# EAGLE board MasterPCB_transfer (EAGLE 9.6.2), part 1 of 7
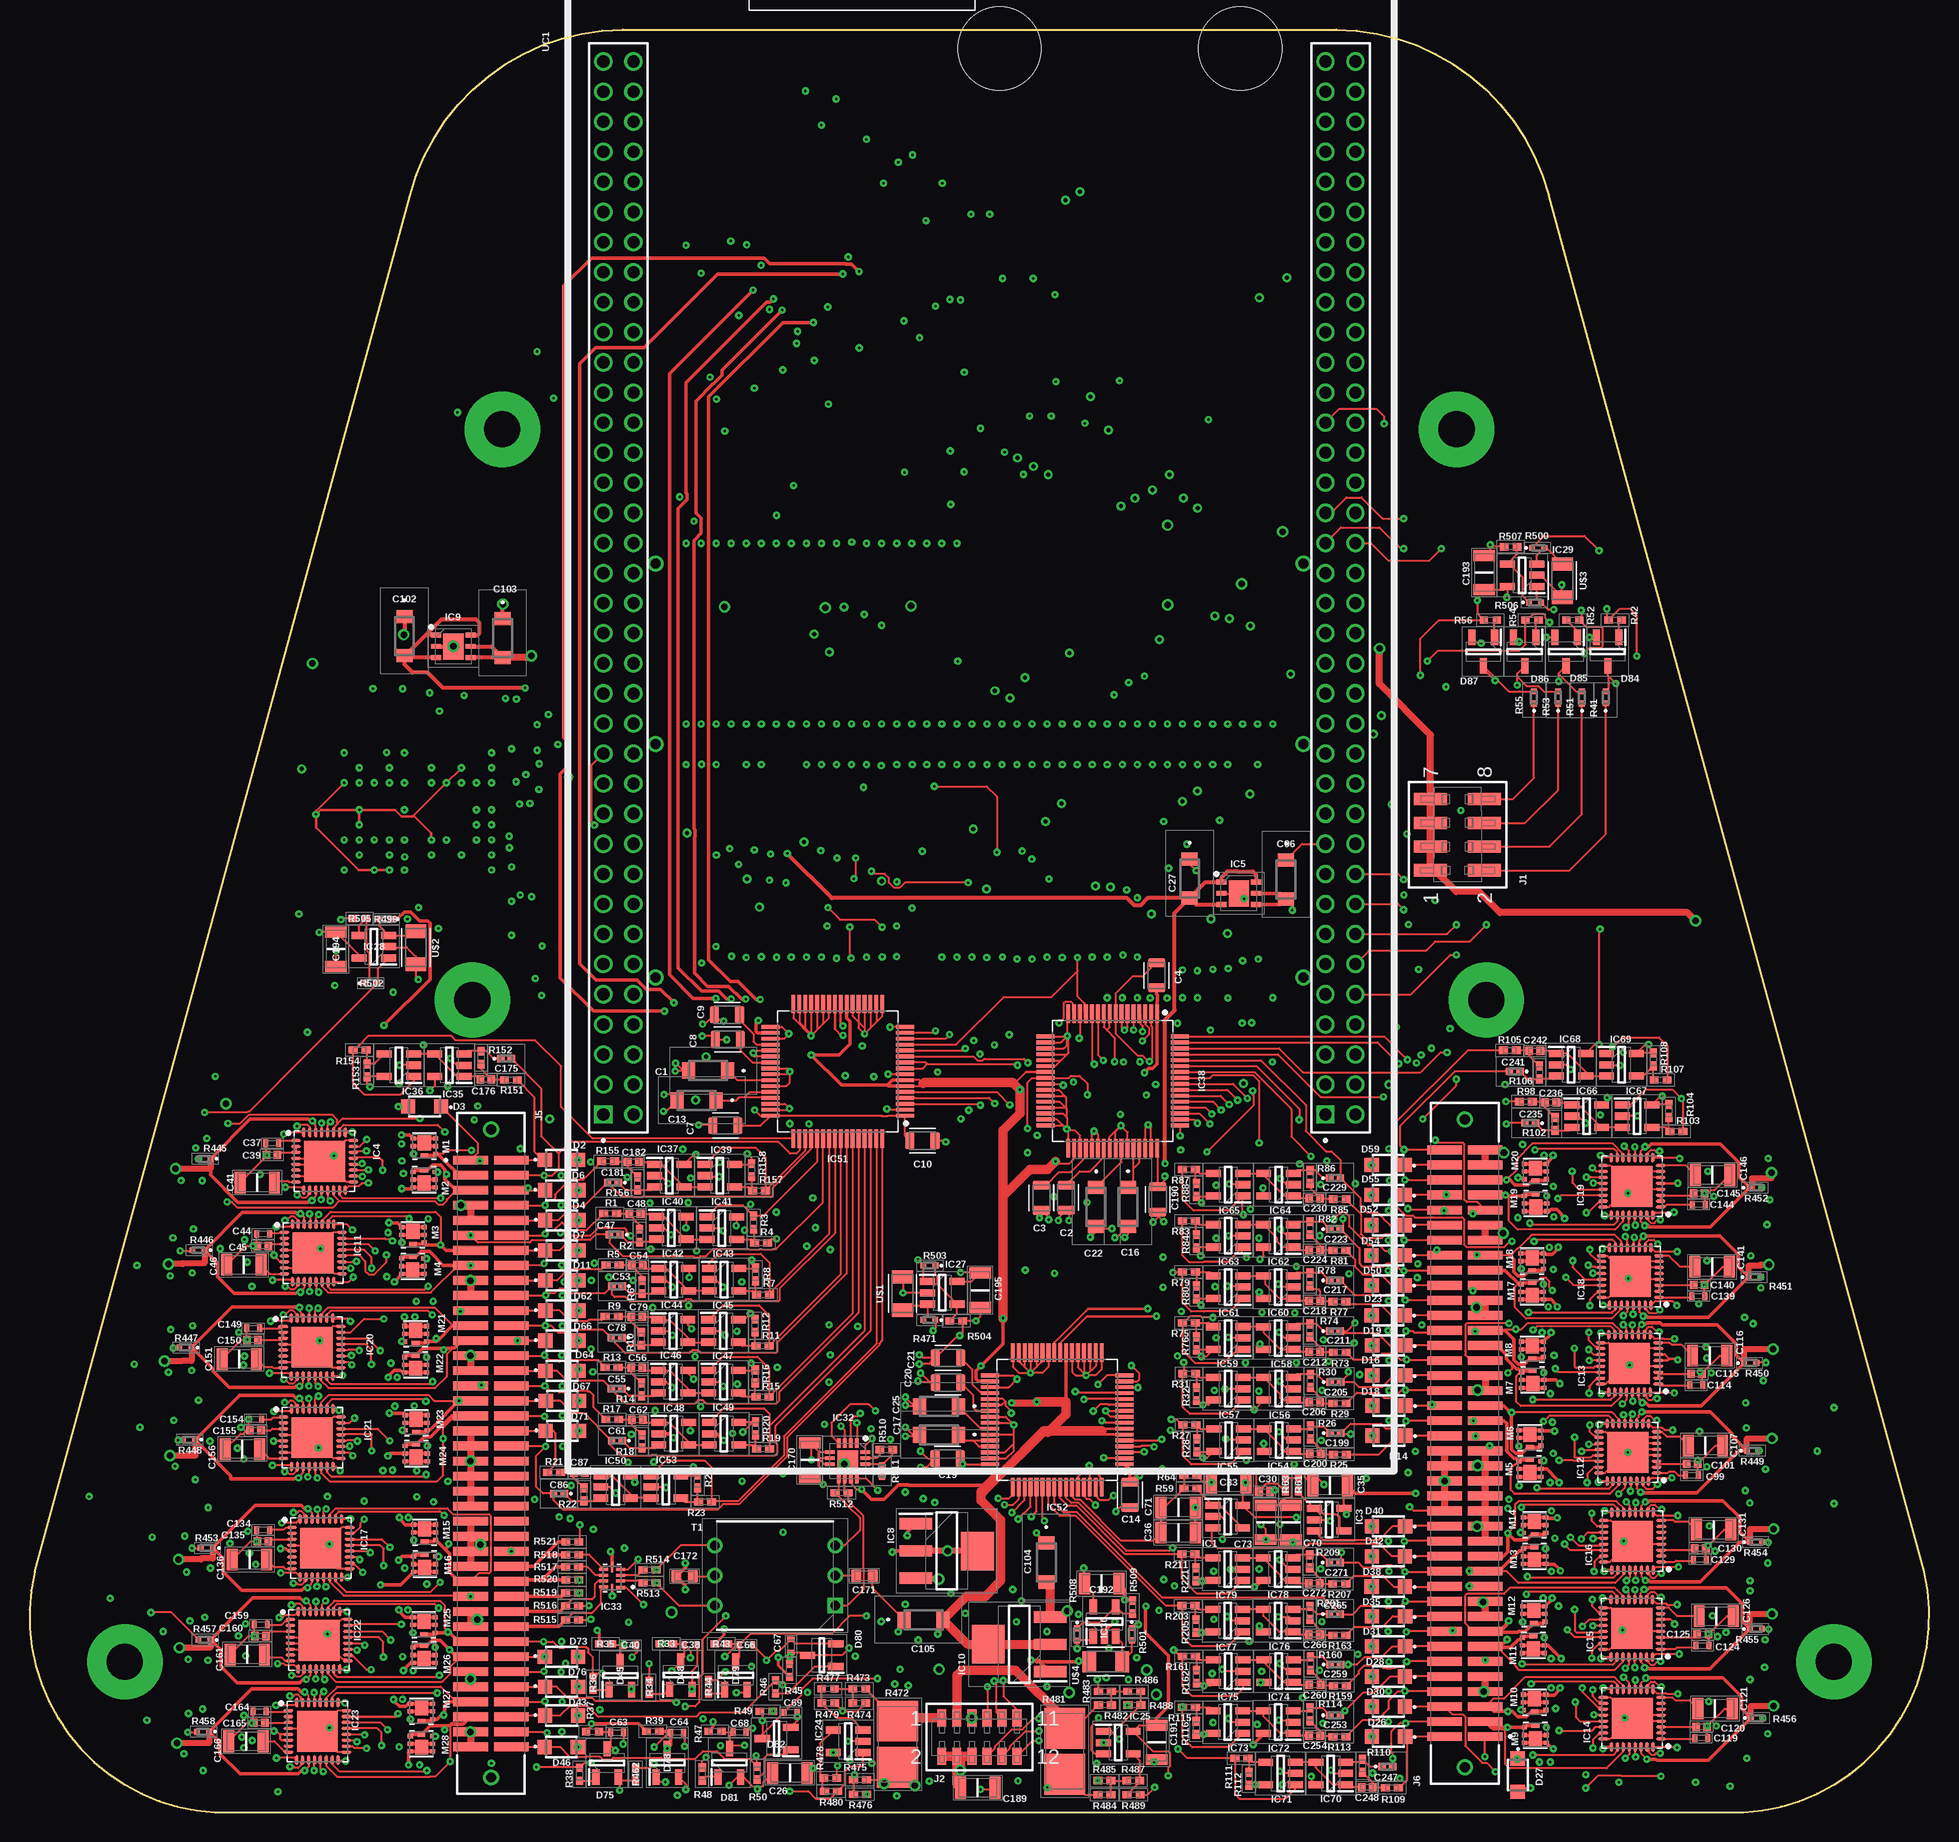
[diagram p21: board, top side]
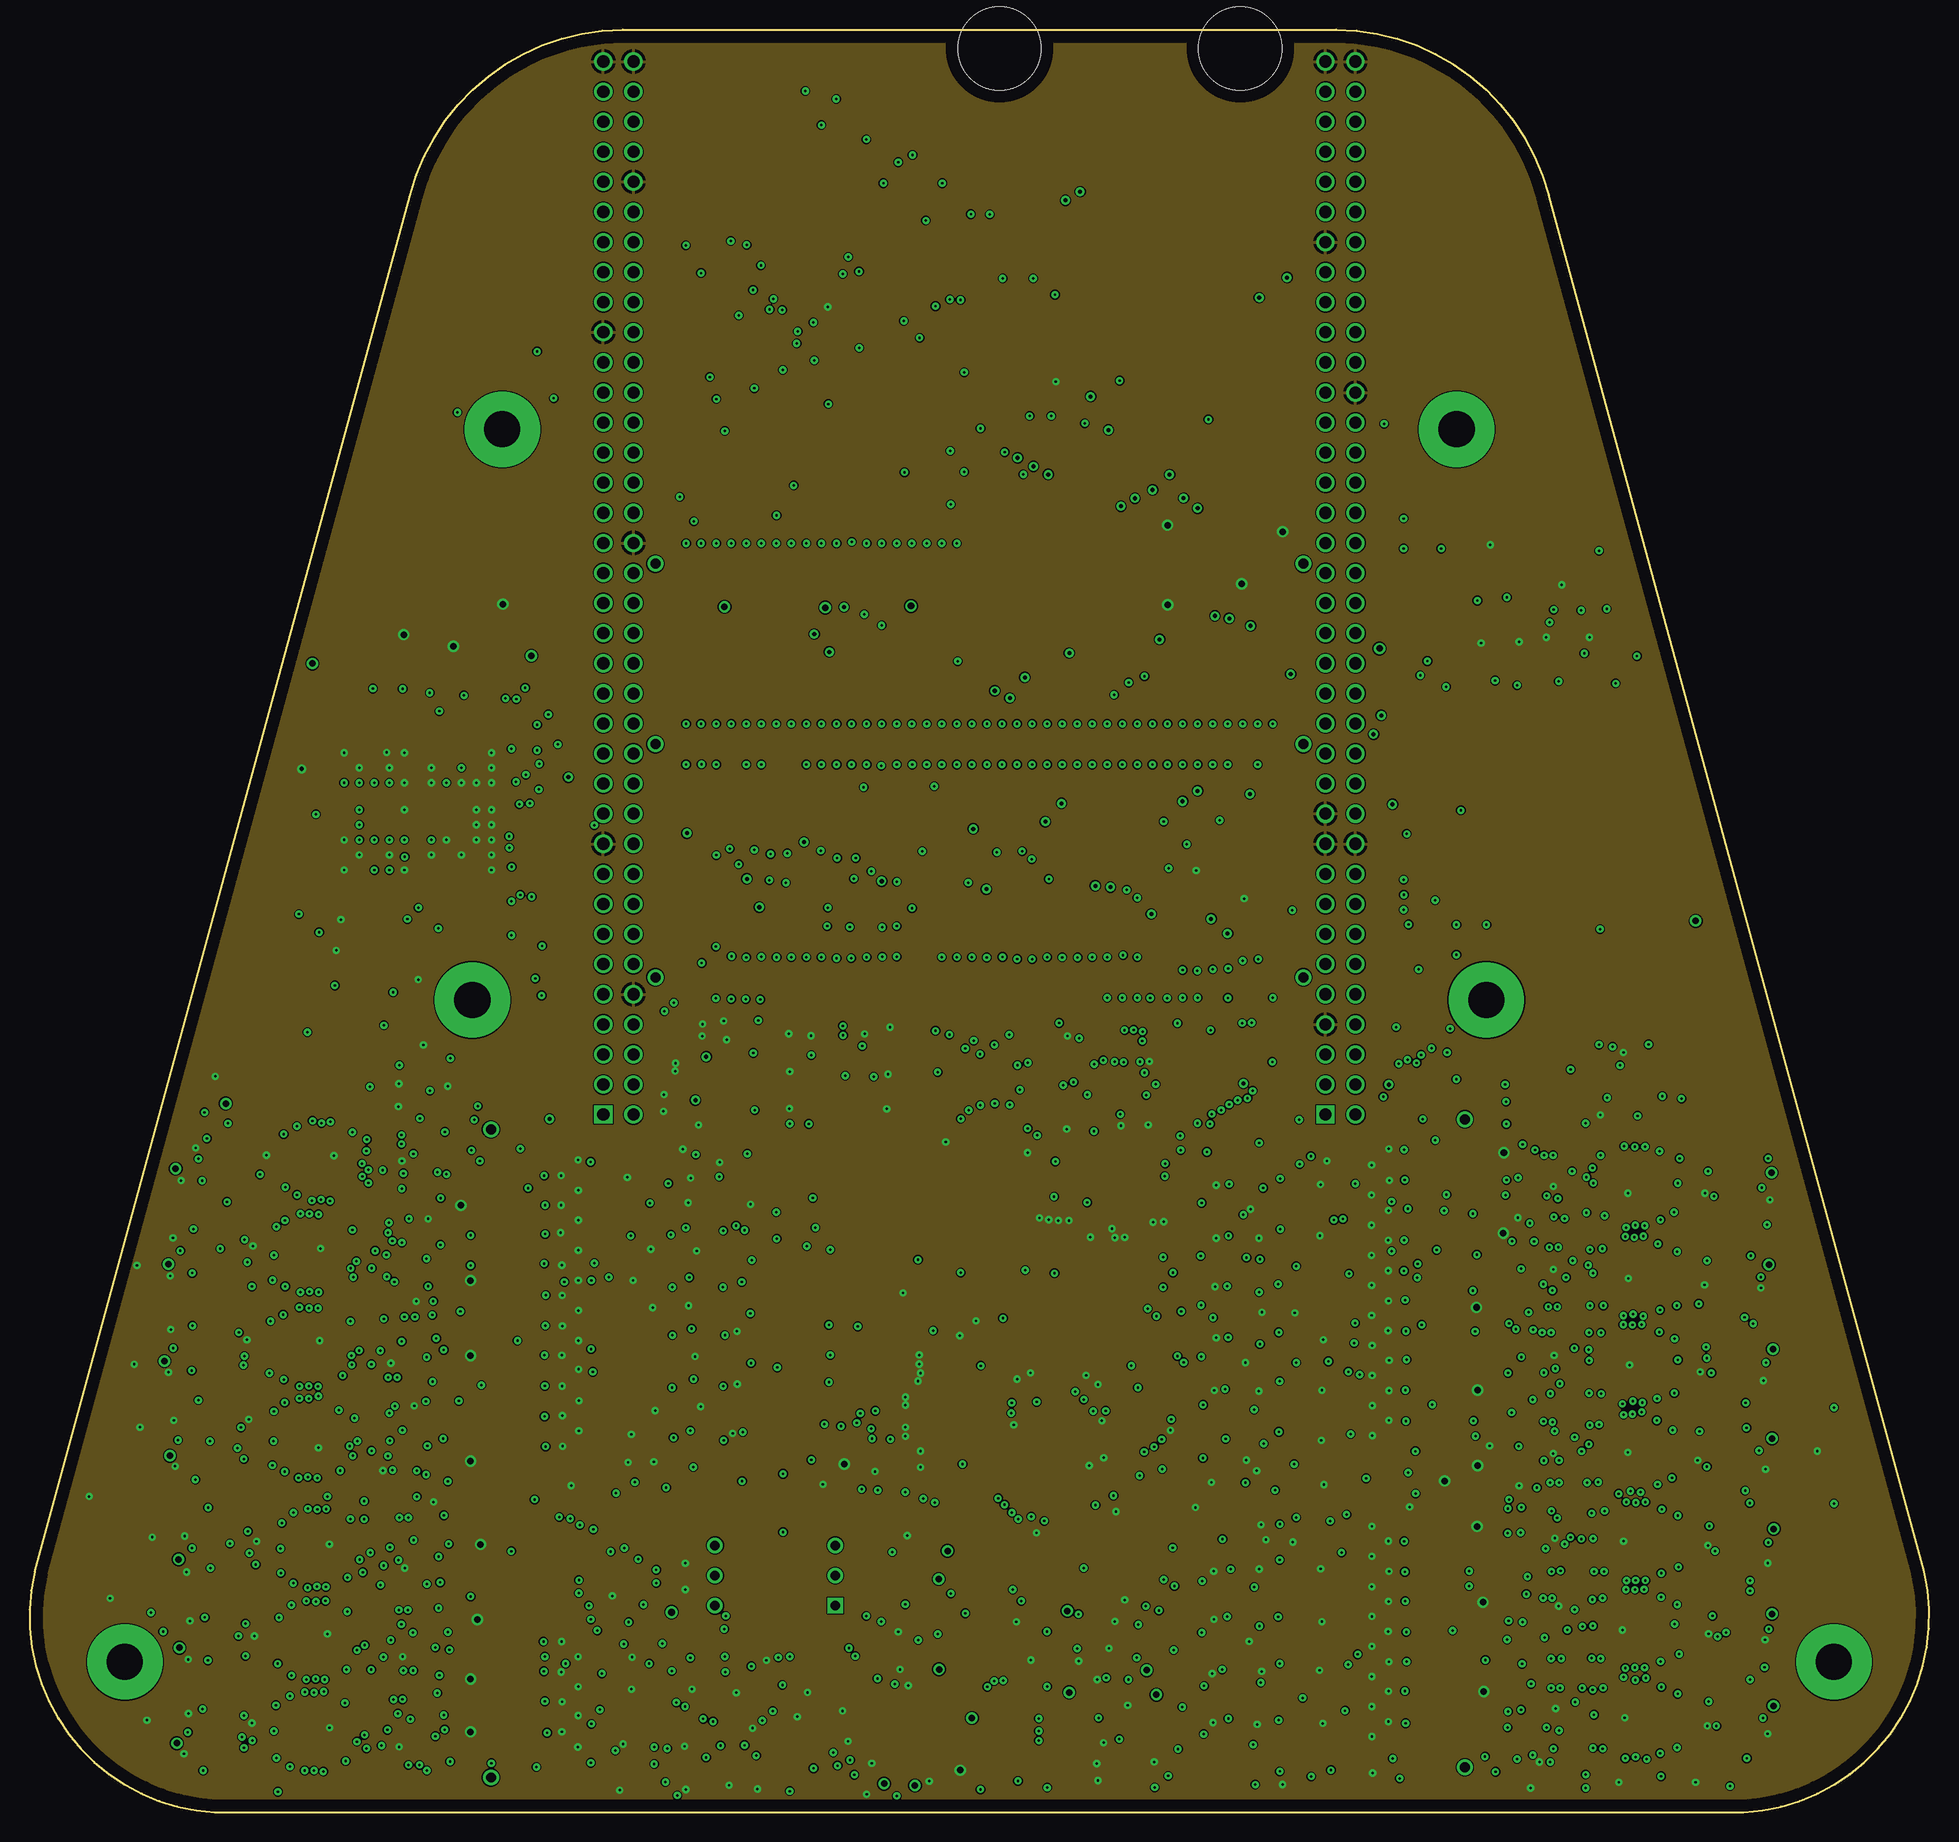
[diagram p22: board, inner layer Route2]
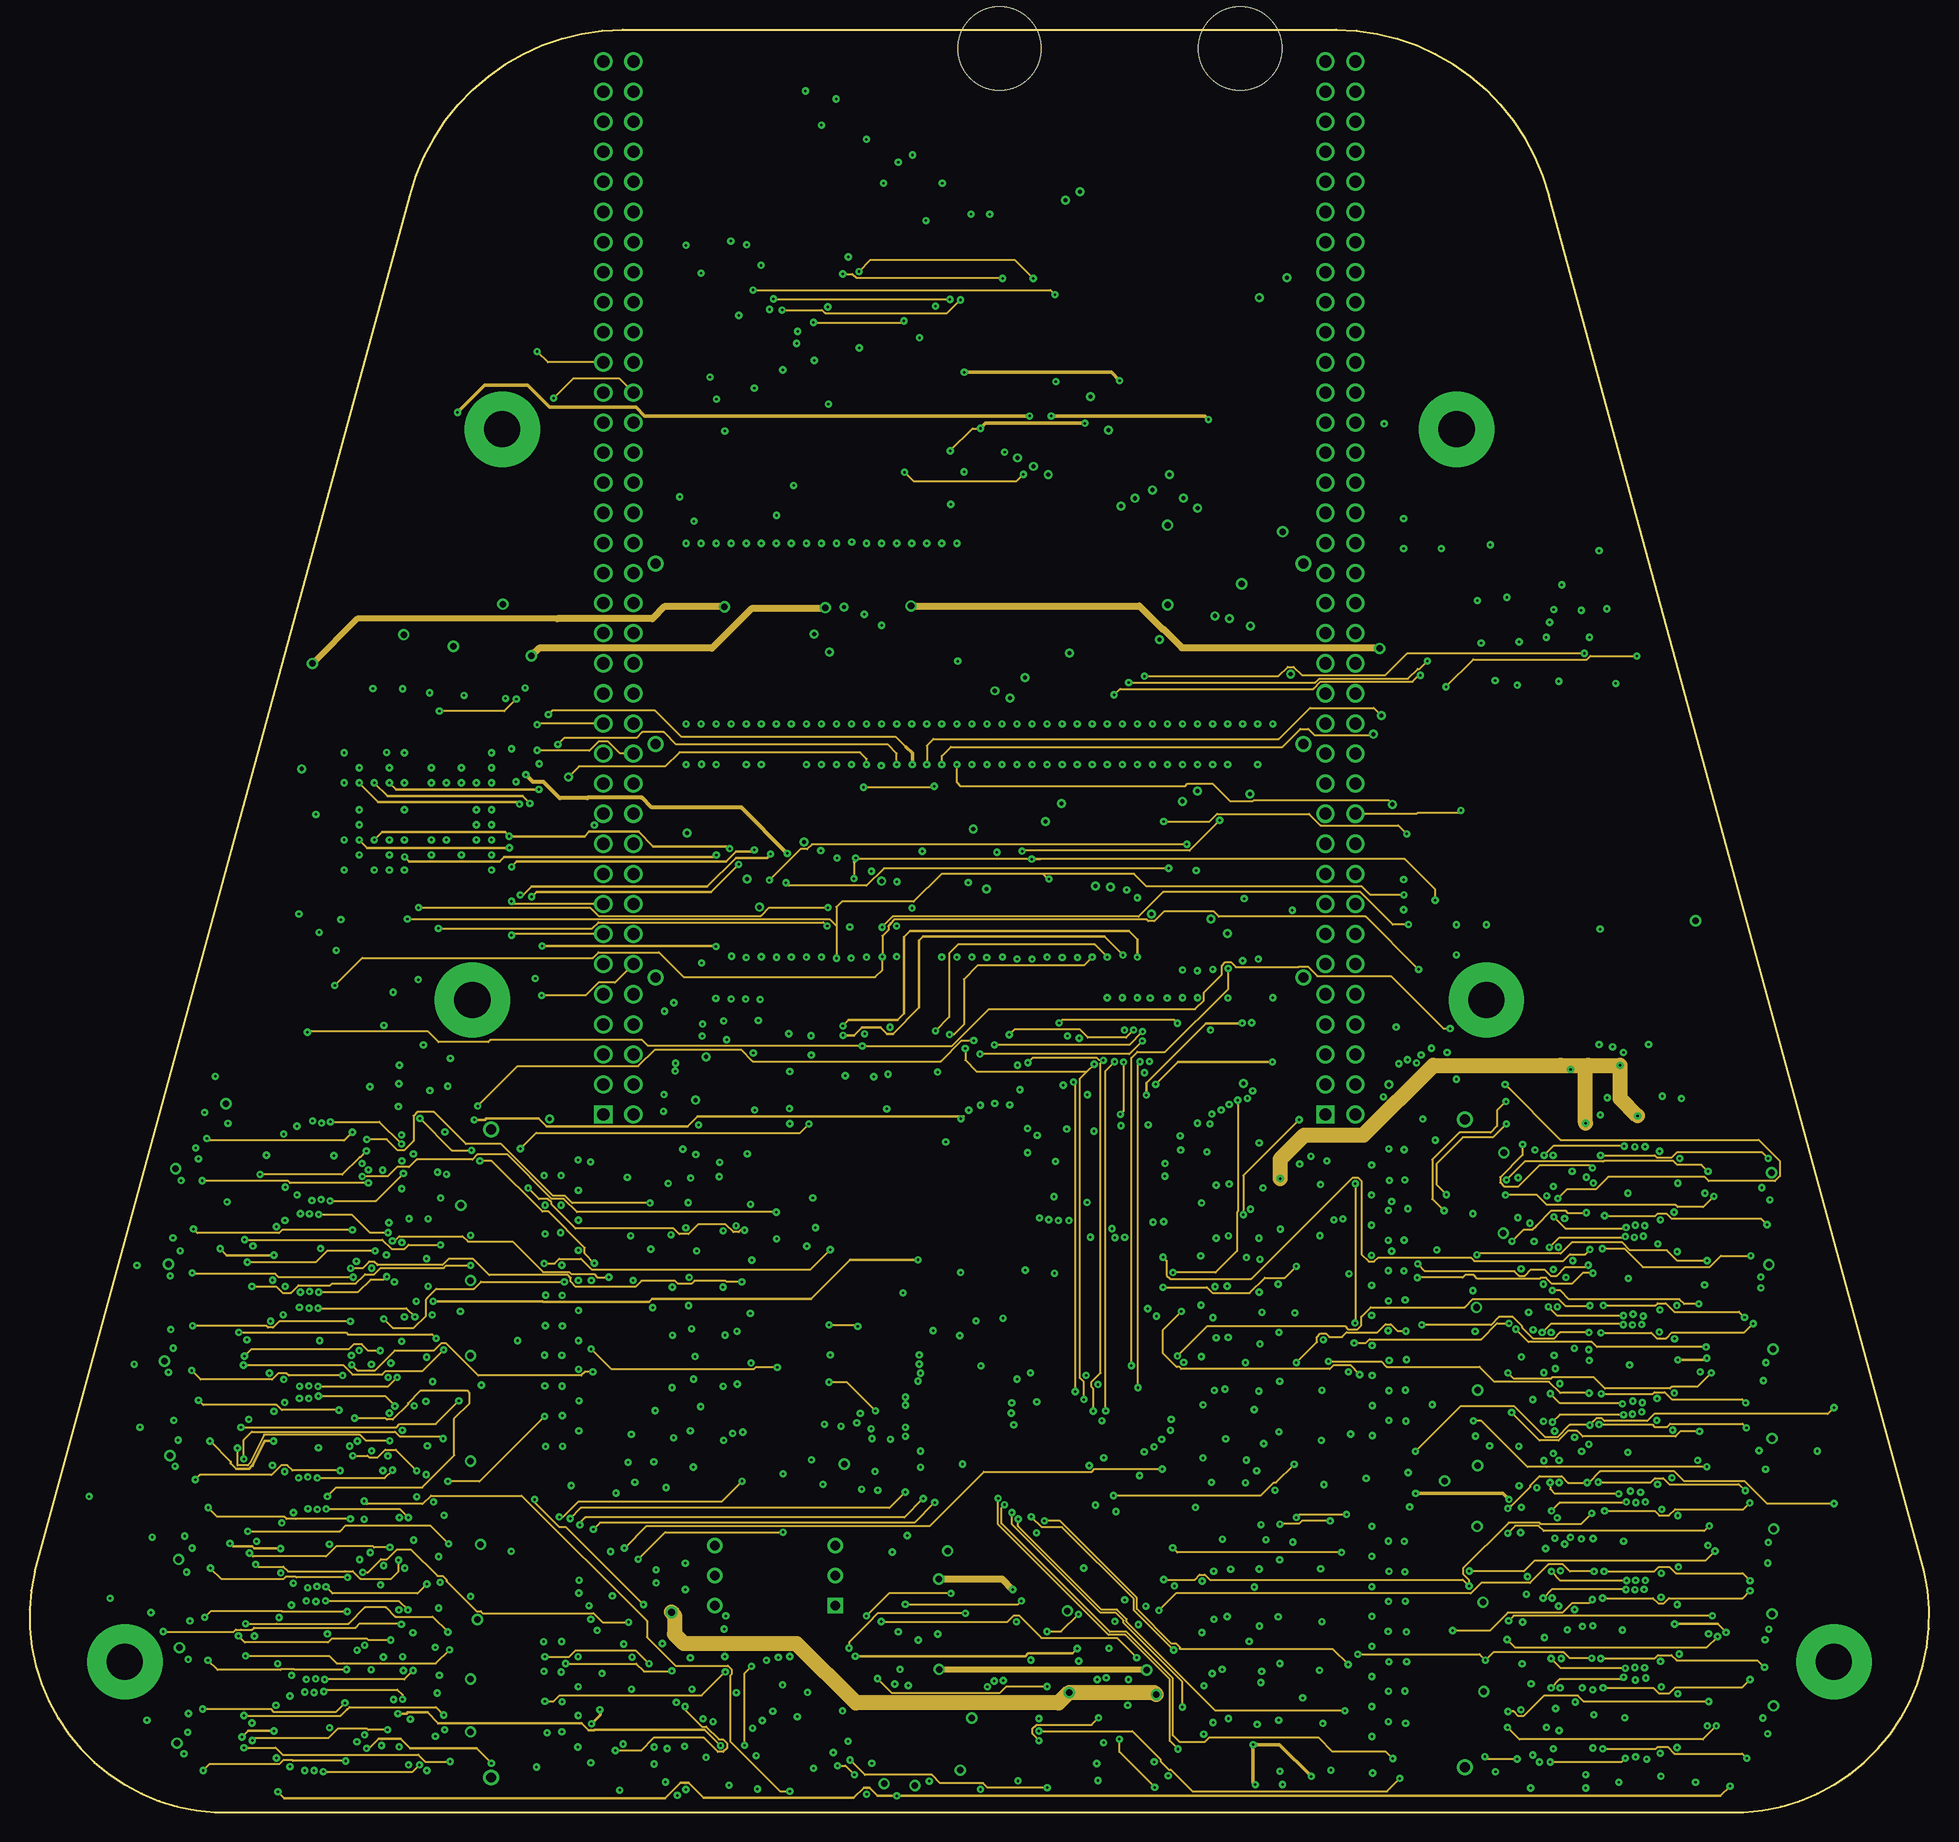
[diagram p23: board, inner layer Route3]
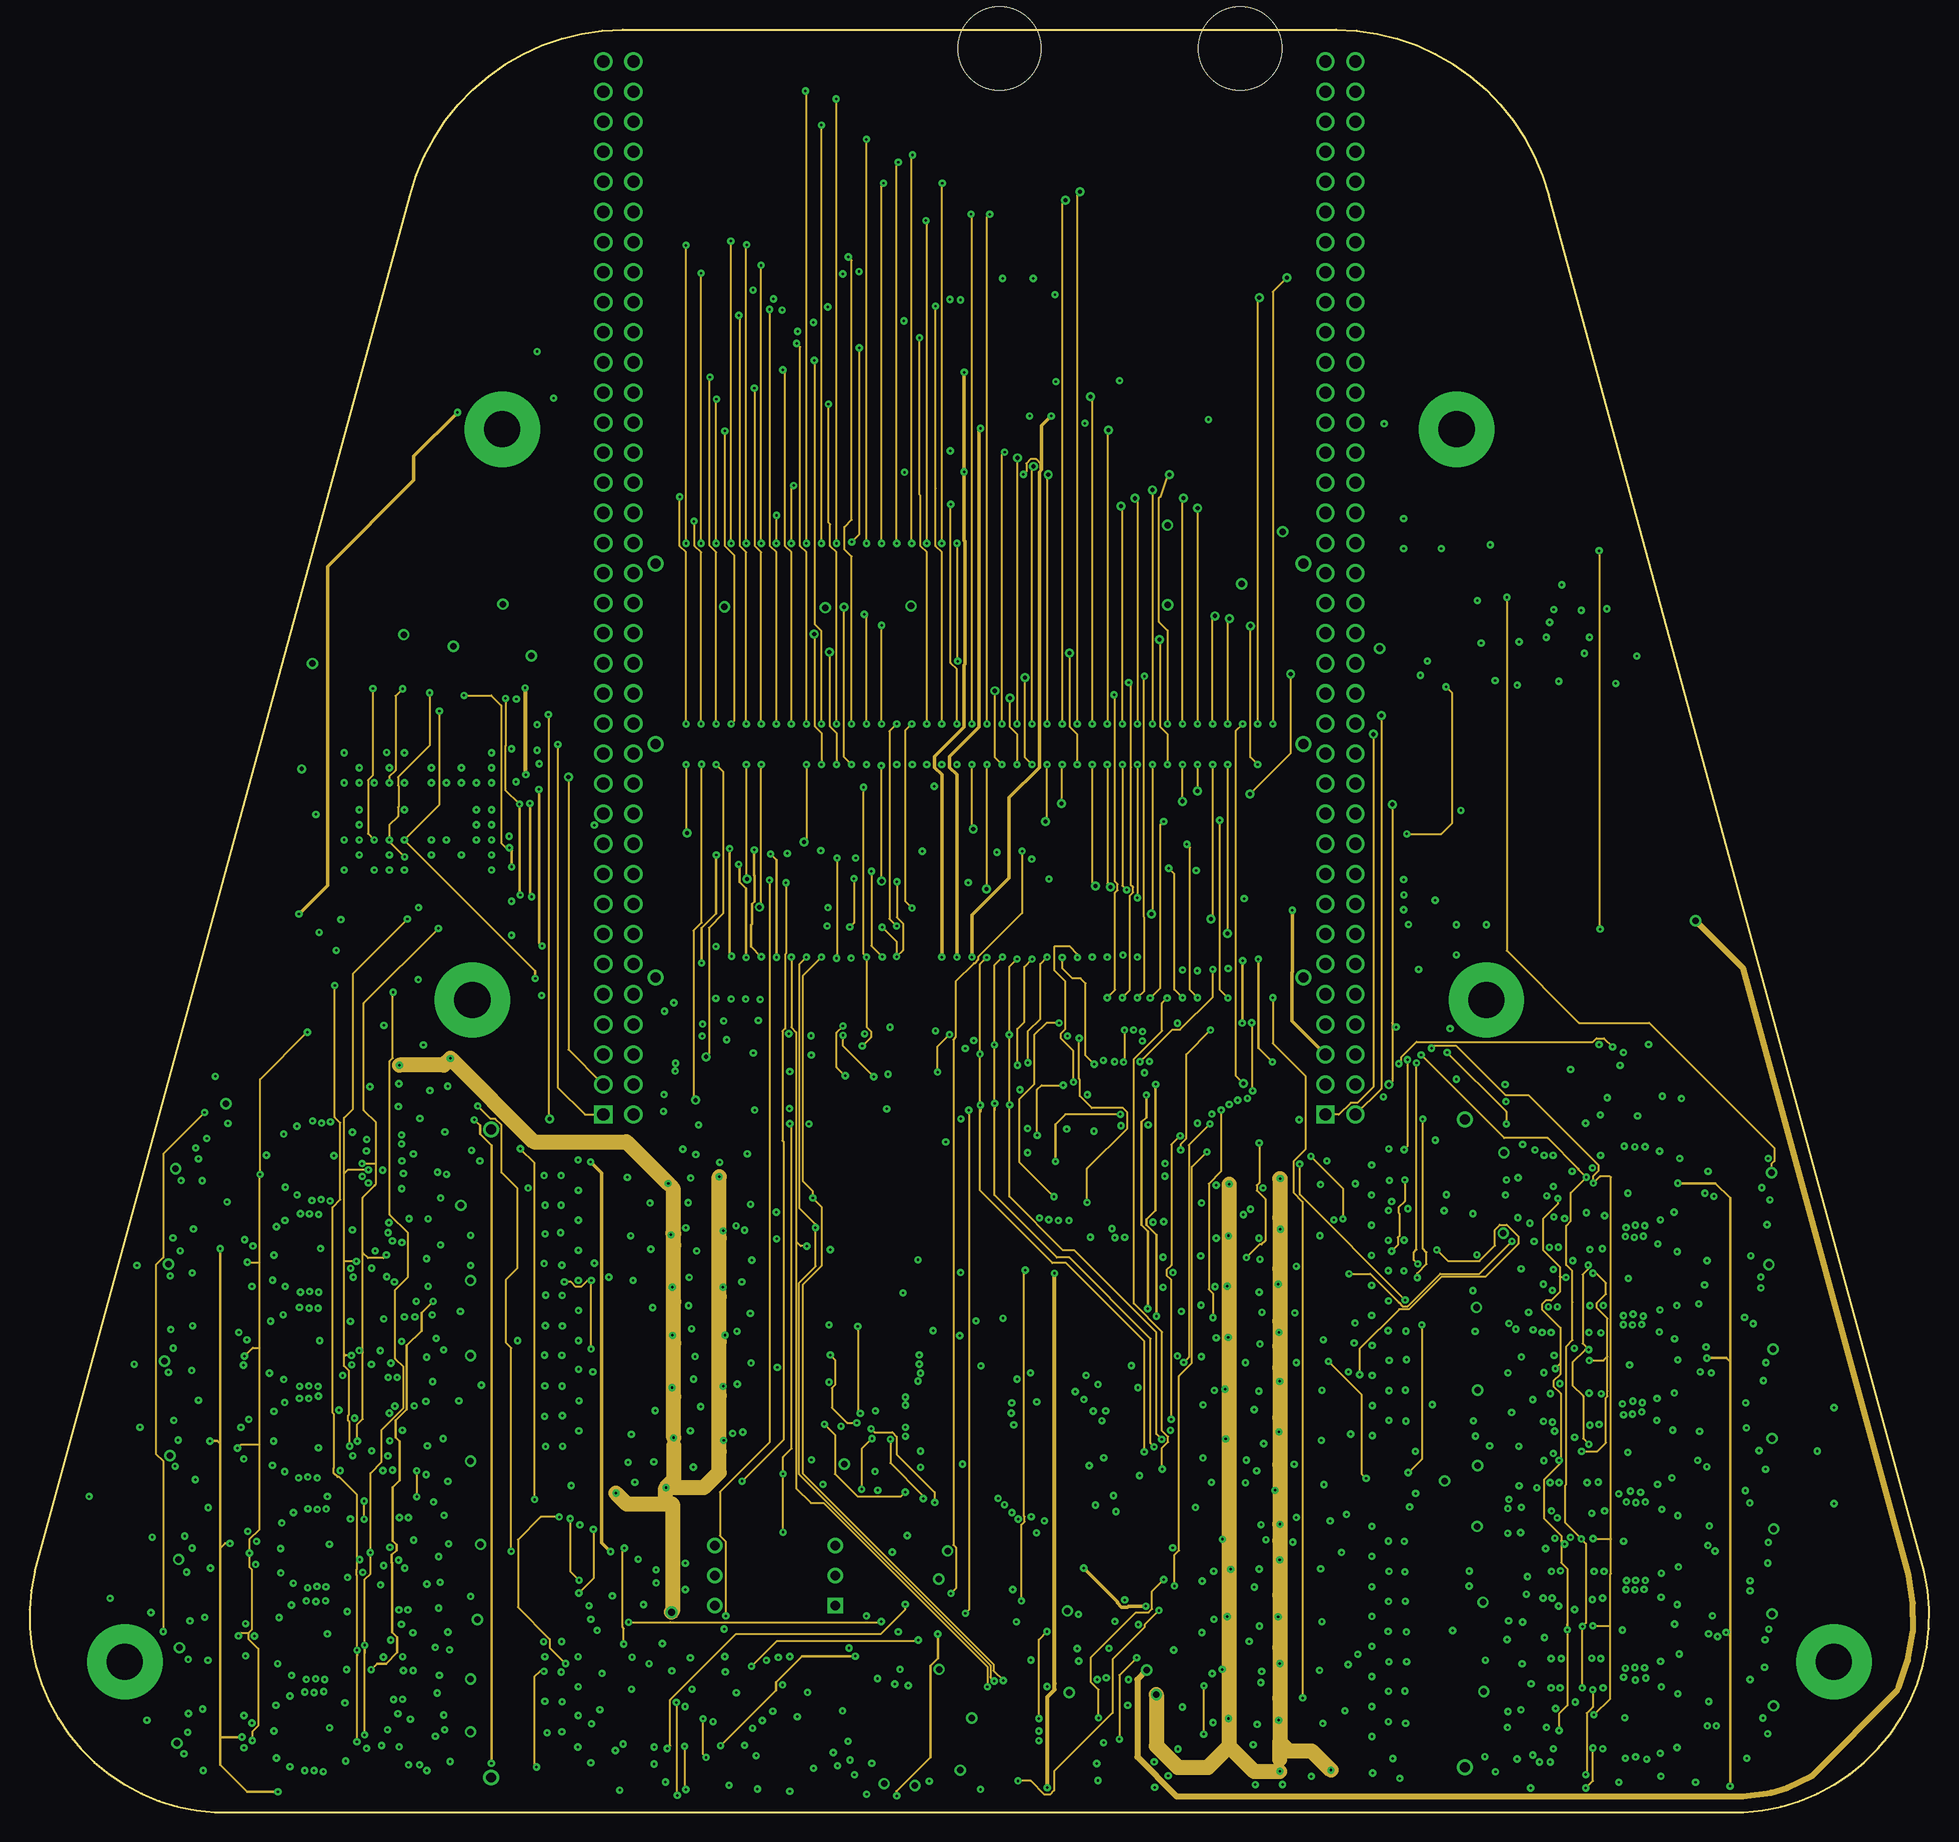
[diagram p24: board, inner layer Route14]
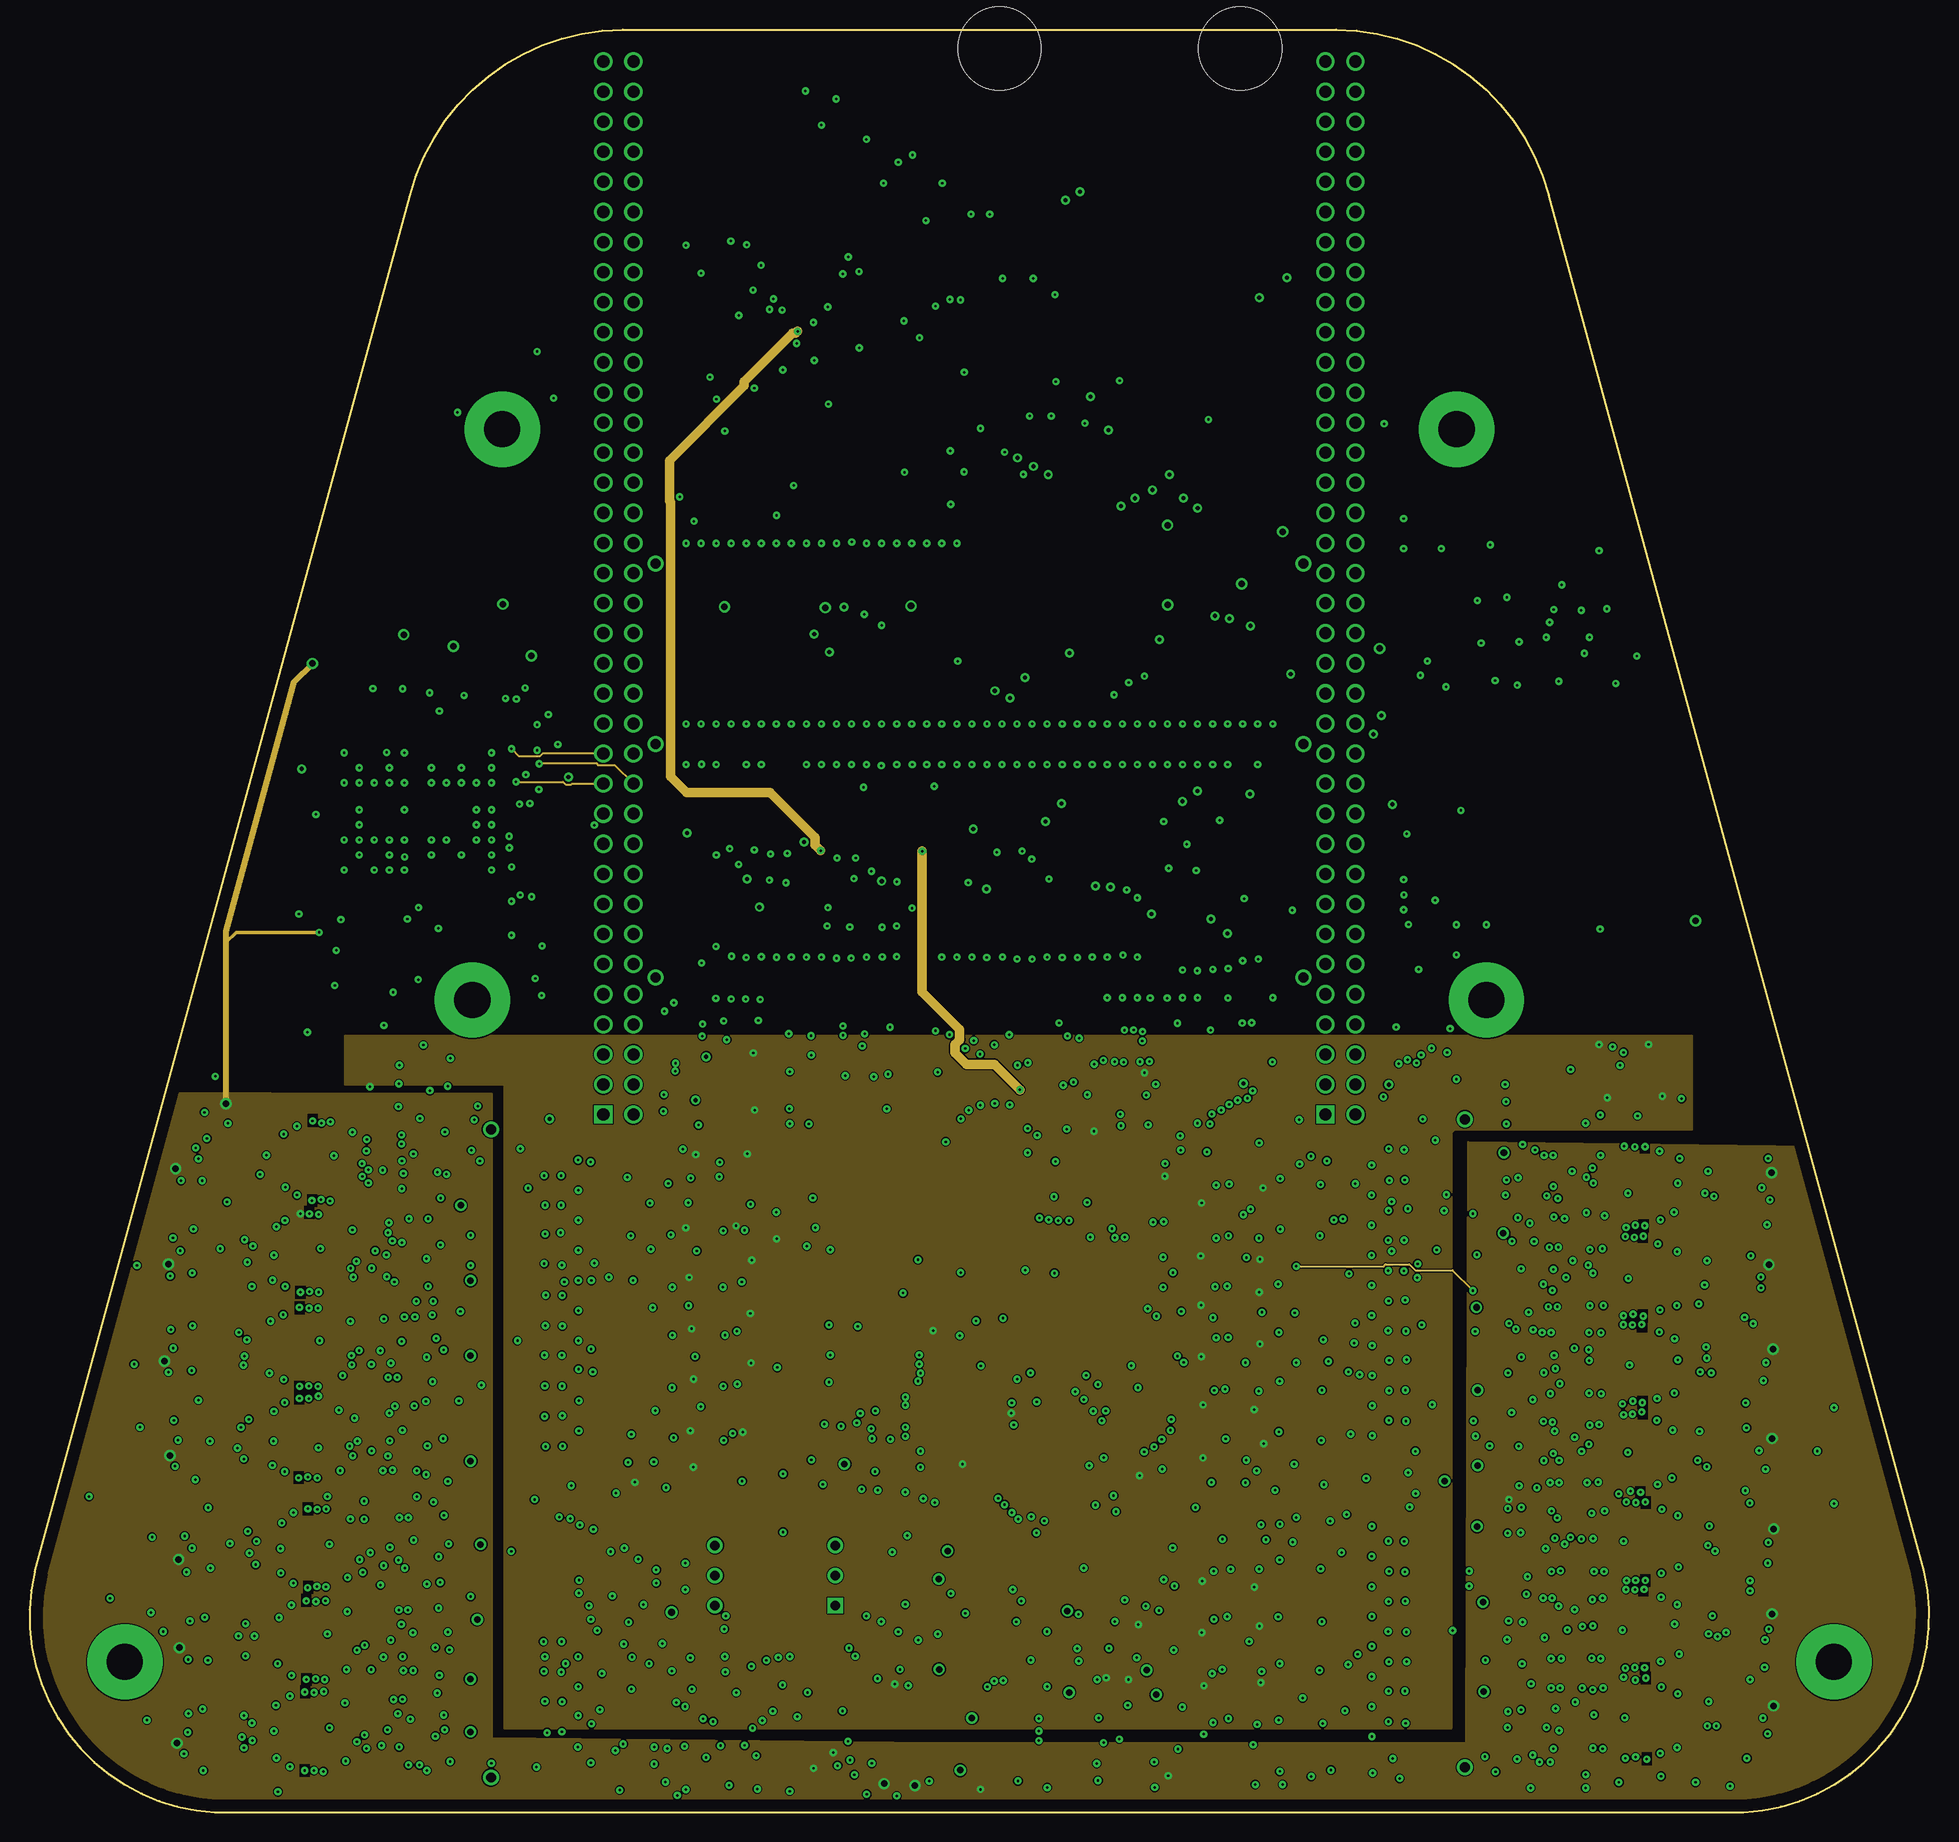
[diagram p25: board, inner layer Route15]
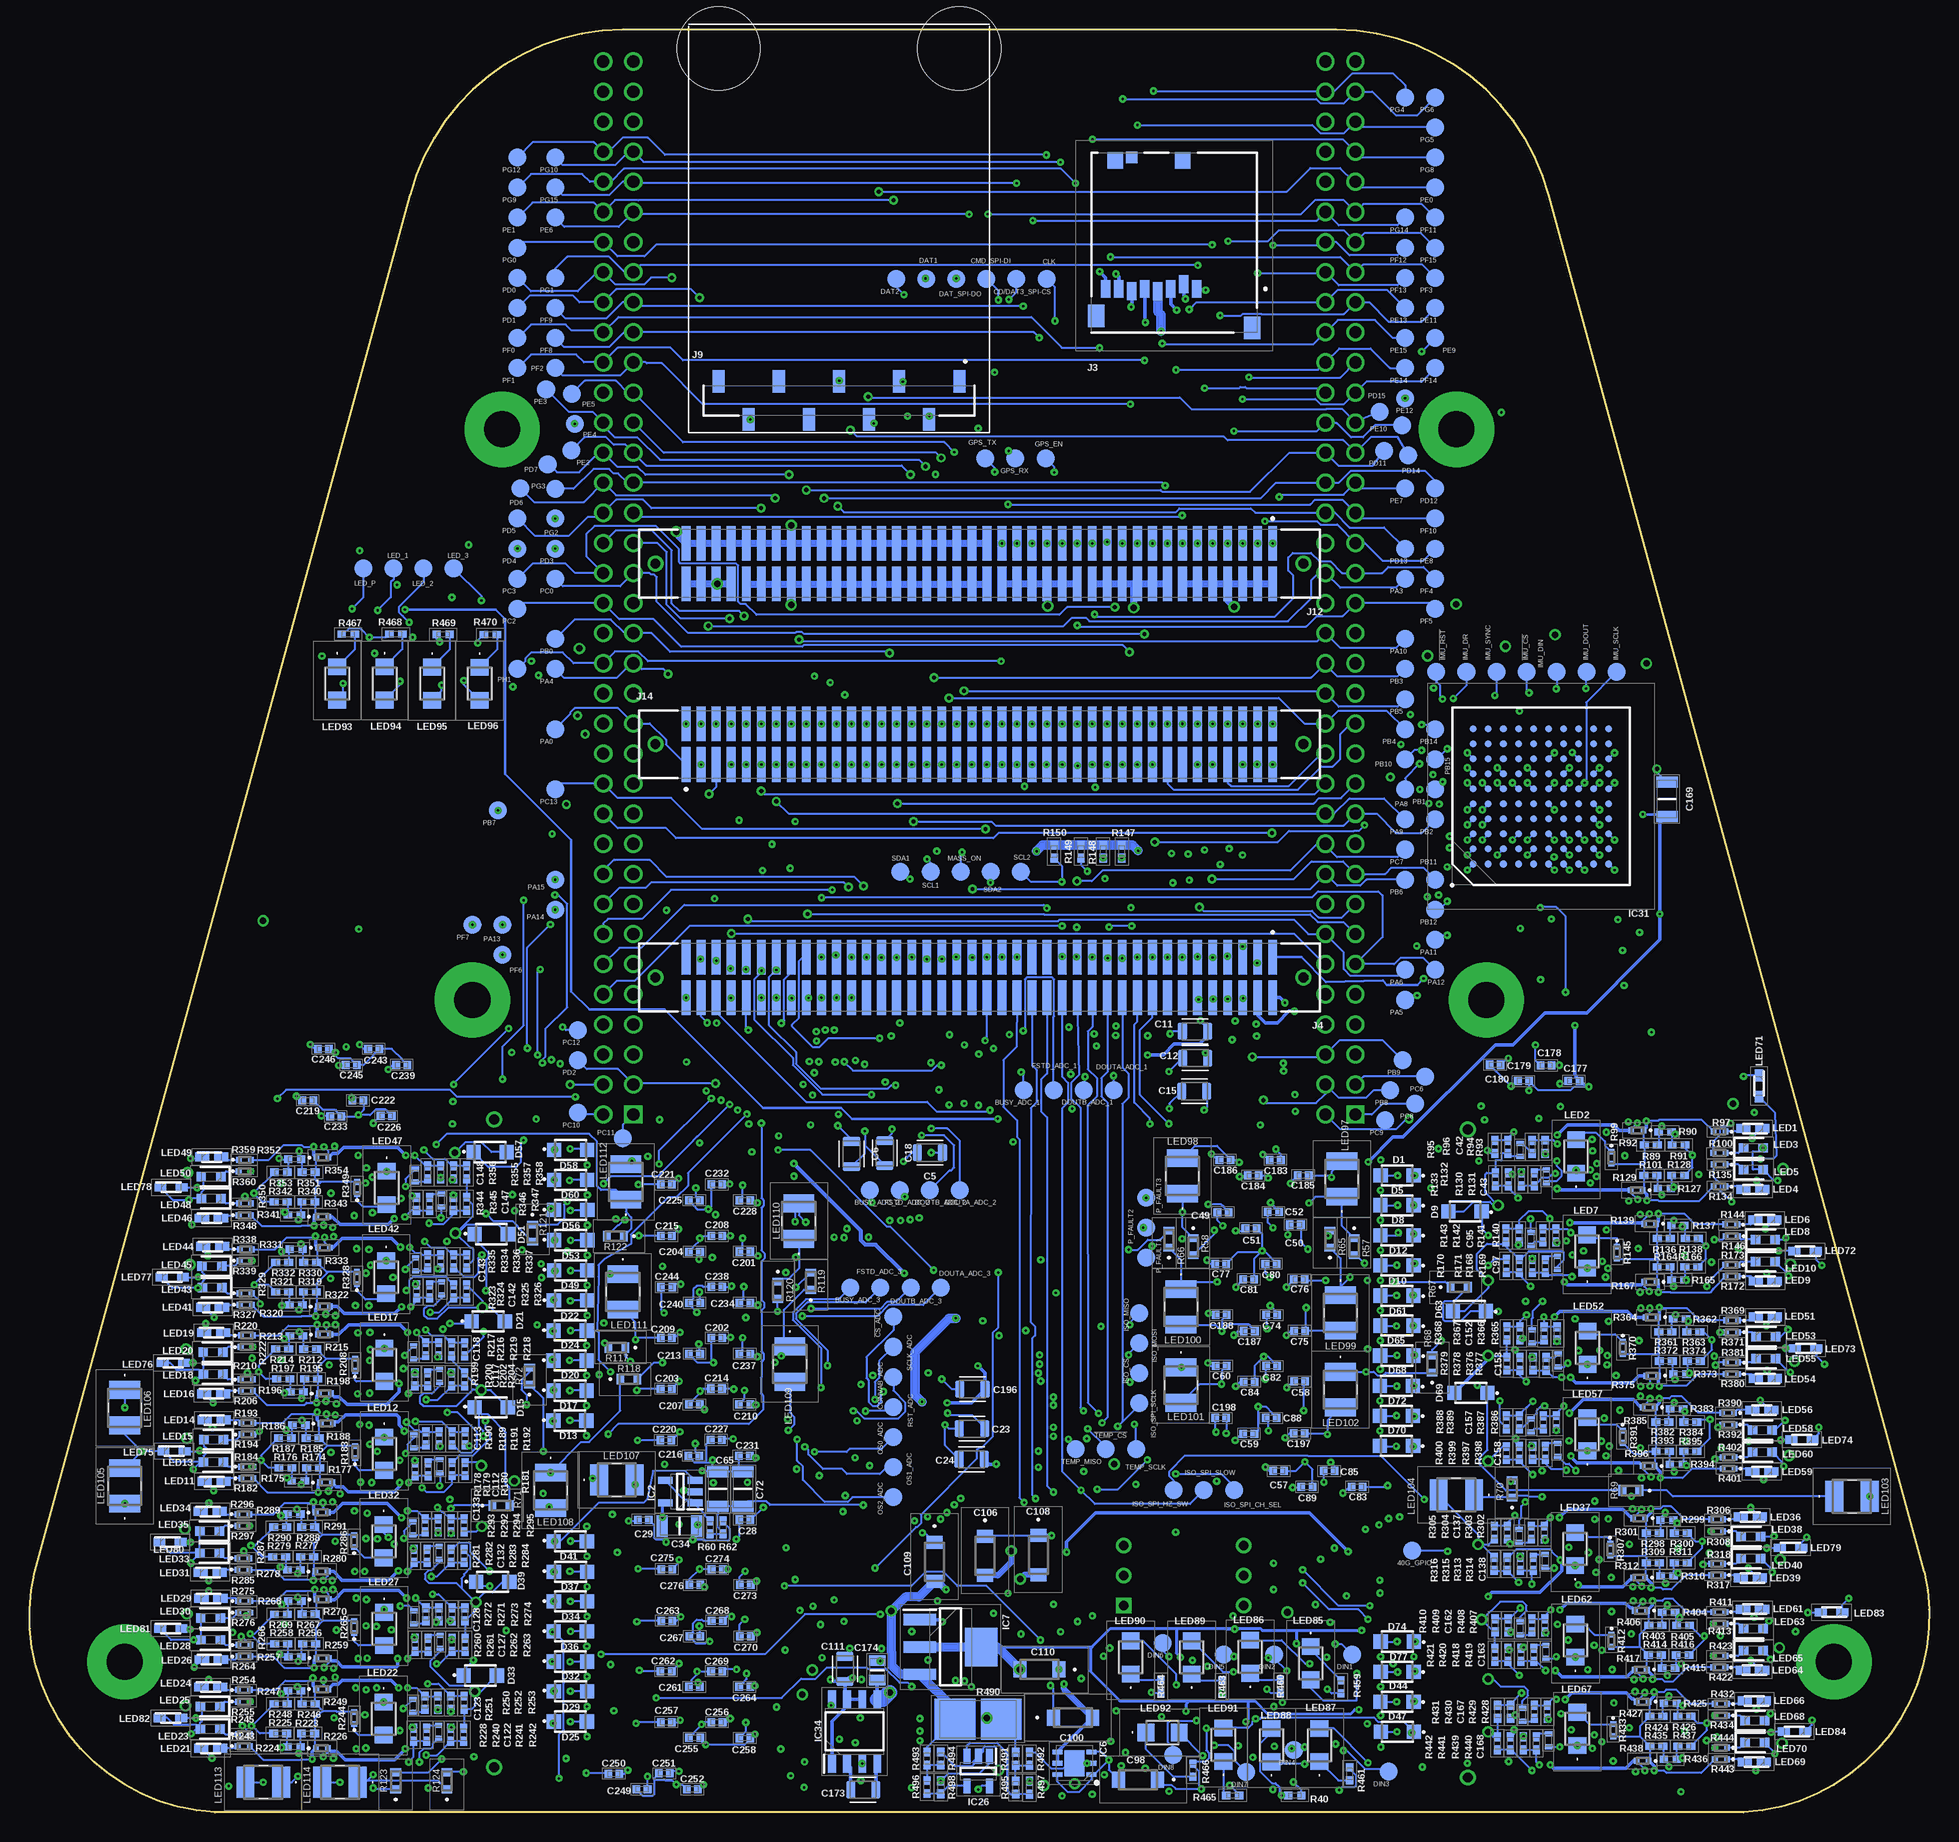
[diagram p26: board, bottom side, seen from below]

Size 160.36 x 150.5 mm. Coordinates in mm from the lower left corner, seen from the top.
Outline: 15.66,0 144.7,0 arc100 159.93,20.32 128.24,136.53 arc75 110.28,150.5 50.08,150.5 arc75 32.12,136.53 0.42,20.32 arc100 15.66,0
Copper layers (1+2*3+14*15+16): Top 0.035mm / dielectric 0.1mm / Route2 0.0175mm / dielectric 0.565mm / Route3 0.0175mm / dielectric 5mil / Route14 0.0175mm / dielectric 0.565mm / Route15 0.035mm / dielectric 0.1mm / Bottom 0.035mm
Design rules "default *": minimum track width 6mil, minimum drill 0.2mm, track to track 4mil, track to pad 6mil, pad to pad 6mil, via to via 6mil, smd to smd 6mil, copper to edge 40mil, drill to drill 6mil, minimum pad ring 10mil, minimum via ring 8mil, stop-mask expansion 4mil, vias tented up to drill 40mil, thermal gap 10mil

## Footprints (pad centres in the part's own frame; a part is rotated, then mirrored left to right if it is on the bottom)
SMALL_TP = smd 1.524 x 1.524: TP 0,0
C3216_COMMERCIAL = smd 1.1 x 1.35: 1 -1.65,0; 2 1.65,0
CAPC2012X145N = smd 0.792 x 1.465: 1 -1.062,0; 2 1.062,0
CAPC3216X180N = smd 0.92 x 1.82: 1 -1.45,0; 2 1.45,0
CAPC1005X65N = smd 0.64 x 0.68: 1 -0.47,0; 2 0.47,0
0402CAP = smd 0.42 x 0.62: 1 -0.55,0; 2 0.55,0
CAPC1005X55N = smd 0.42 x 0.62: 1 -0.55,0; 2 0.55,0
C0402 = smd 0.62 x 0.62: 1 -0.45,0; 2 0.45,0
CAPC2012X135N = smd 0.91 x 1.39: 1 -0.82,0; 2 0.82,0
CAPC1608X90N = smd 0.78 x 0.99: 1 -0.7,0; 2 0.7,0
SOD123W = smd 1.2 x 1.2: 1 -1.4,0; 2 1.4,0
SOT95P280X100-3N = smd 1.3 x 0.6: 1 -1.2,0.95; 2 -1.2,-0.95; 3 1.2,0
SOT95P275X110-5N = smd 1.25 x 0.6: 1 -1.25,0.95; 2 -1.25,0; 3 -1.25,-0.95; 4 1.25,-0.95; 5 1.25,0.95
QFN50P500X500X80-33T345N = smd 0.848 x 0.247: 1 -2.433,1.75; 2 -2.433,1.25; 3 -2.433,0.75; 4 -2.433,0.25; 5 -2.433,-0.25; 6 -2.433,-0.75; 7 -2.433,-1.25; 8 -2.433,-1.75; 17 2.433,-1.75; 18 2.433,-1.25; 19 2.433,-0.75; 20 2.433,-0.25; 21 2.433,0.25; 22 2.433,0.75; 23 2.433,1.25; 24 2.433,1.75 | smd 0.247 x 0.848: 9 -1.75,-2.433; 10 -1.25,-2.433; 11 -0.75,-2.433; 12 -0.25,-2.433; 13 0.25,-2.433; 14 0.75,-2.433; 15 1.25,-2.433; 16 1.75,-2.433; 25 1.75,2.433; 26 1.25,2.433; 27 0.75,2.433; 28 0.25,2.433; 29 -0.25,2.433; 30 -0.75,2.433; 31 -1.25,2.433; 32 -1.75,2.433 | smd 3.45 x 3.45: 33 0,0
SON95P300X300X80-7N = smd 0.85 x 0.4: 1 -1.45,0.95; 2 -1.45,0; 3 -1.45,-0.95; 4 1.45,-0.95; 5 1.45,0; 6 1.45,0.95 | smd 1.7 x 2.2: 7 0,0
SOT230P700X180-4N = smd 2.75 x 0.95: 1 -2.6,2.3; 2 -2.6,0; 3 -2.6,-2.3 | smd 2.75 x 3.25: 4 2.6,0
BGA100C127P10X10_1500X1500X608 = smd 0.612 x 0.612: A1 -5.715,5.715; A2 -4.445,5.715; A3 -3.175,5.715; A4 -1.905,5.715; A5 -0.635,5.715; A6 0.635,5.715; A7 1.905,5.715; A8 3.175,5.715; A9 4.445,5.715; A10 5.715,5.715; B1 -5.715,4.445; B2 -4.445,4.445; B3 -3.175,4.445; B4 -1.905,4.445; B5 -0.635,4.445; B6 0.635,4.445; B7 1.905,4.445; B8 3.175,4.445; B9 4.445,4.445; B10 5.715,4.445; C1 -5.715,3.175; C2 -4.445,3.175; C3 -3.175,3.175; C4 -1.905,3.175; C5 -0.635,3.175; C6 0.635,3.175; C7 1.905,3.175; C8 3.175,3.175; C9 4.445,3.175; C10 5.715,3.175; D1 -5.715,1.905; D2 -4.445,1.905; D3 -3.175,1.905; D4 -1.905,1.905; D5 -0.635,1.905; D6 0.635,1.905; D7 1.905,1.905; D8 3.175,1.905; D9 4.445,1.905; D10 5.715,1.905; E1 -5.715,0.635; E2 -4.445,0.635; E3 -3.175,0.635; E4 -1.905,0.635; E5 -0.635,0.635; E6 0.635,0.635; E7 1.905,0.635; E8 3.175,0.635; E9 4.445,0.635; E10 5.715,0.635; F1 -5.715,-0.635; F2 -4.445,-0.635; F3 -3.175,-0.635; F4 -1.905,-0.635; F5 -0.635,-0.635; F6 0.635,-0.635; F7 1.905,-0.635; F8 3.175,-0.635; F9 4.445,-0.635; F10 5.715,-0.635; G1 -5.715,-1.905; G2 -4.445,-1.905; G3 -3.175,-1.905; G4 -1.905,-1.905; G5 -0.635,-1.905; G6 0.635,-1.905; G7 1.905,-1.905; G8 3.175,-1.905; G9 4.445,-1.905; G10 5.715,-1.905; H1 -5.715,-3.175; H2 -4.445,-3.175; H3 -3.175,-3.175; H4 -1.905,-3.175; H5 -0.635,-3.175; H6 0.635,-3.175; H7 1.905,-3.175; H8 3.175,-3.175; H9 4.445,-3.175; H10 5.715,-3.175; J1 -5.715,-4.445; J2 -4.445,-4.445; J3 -3.175,-4.445; J4 -1.905,-4.445; J5 -0.635,-4.445; J6 0.635,-4.445; J7 1.905,-4.445; J8 3.175,-4.445; J9 4.445,-4.445; J10 5.715,-4.445; K1 -5.715,-5.715; K2 -4.445,-5.715; K3 -3.175,-5.715; K4 -1.905,-5.715; K5 -0.635,-5.715; K6 0.635,-5.715; K7 1.905,-5.715; K8 3.175,-5.715; K9 4.445,-5.715; K10 5.715,-5.715
QFN50P300X300X80-17N = smd 0.8 x 0.3: 1 -1.5,0.75; 2 -1.5,0.25; 3 -1.5,-0.25; 4 -1.5,-0.75; 9 1.5,-0.75; 10 1.5,-0.25; 11 1.5,0.25; 12 1.5,0.75 | smd 0.3 x 0.8: 5 -0.75,-1.5; 6 -0.25,-1.5; 7 0.25,-1.5; 8 0.75,-1.5; 13 0.75,1.5; 14 0.25,1.5; 15 -0.25,1.5; 16 -0.75,1.5 | smd 1.75 x 1.75: 17 0,0
QFN50P200X155X50-10N = smd 0.84 x 0.3: 1 -0.71,0.79 | smd 0.84 x 0.22: 2 -0.71,0.25; 3 -0.71,-0.25; 4 -0.71,-0.75; 6 0.71,-0.75; 7 0.71,-0.25; 8 0.71,0.25; 9 0.71,0.75 | smd 0.22 x 0.84: 5 0,-0.935; 10 0,0.935
SOIC127P600X175-8N = smd 1.525 x 0.65: 1 -2.712,1.905; 2 -2.712,0.635; 3 -2.712,-0.635; 4 -2.712,-1.905; 5 2.712,-1.905; 6 2.712,-0.635; 7 2.712,0.635; 8 2.712,1.905
QFP50P1200X1200X160-64N_NO_3D = smd 1.549 x 0.317: 1 -5.677,3.75; 2 -5.677,3.25; 3 -5.677,2.75; 4 -5.677,2.25; 5 -5.677,1.75; 6 -5.677,1.25; 7 -5.677,0.75; 8 -5.677,0.25; 9 -5.677,-0.25; 10 -5.677,-0.75; 11 -5.677,-1.25; 12 -5.677,-1.75; 13 -5.677,-2.25; 14 -5.677,-2.75; 15 -5.677,-3.25; 16 -5.677,-3.75; 33 5.677,-3.75; 34 5.677,-3.25; 35 5.677,-2.75; 36 5.677,-2.25; 37 5.677,-1.75; 38 5.677,-1.25; 39 5.677,-0.75; 40 5.677,-0.25; 41 5.677,0.25; 42 5.677,0.75; 43 5.677,1.25; 44 5.677,1.75; 45 5.677,2.25; 46 5.677,2.75; 47 5.677,3.25; 48 5.677,3.75 | smd 0.317 x 1.549: 17 -3.75,-5.677; 18 -3.25,-5.677; 19 -2.75,-5.677; 20 -2.25,-5.677; 21 -1.75,-5.677; 22 -1.25,-5.677; 23 -0.75,-5.677; 24 -0.25,-5.677; 25 0.25,-5.677; 26 0.75,-5.677; 27 1.25,-5.677; 28 1.75,-5.677; 29 2.25,-5.677; 30 2.75,-5.677; 31 3.25,-5.677; 32 3.75,-5.677; 49 3.75,5.677; 50 3.25,5.677; 51 2.75,5.677; 52 2.25,5.677; 53 1.75,5.677; 54 1.25,5.677; 55 0.75,5.677; 56 0.25,5.677; 57 -0.25,5.677; 58 -0.75,5.677; 59 -1.25,5.677; 60 -1.75,5.677; 61 -2.25,5.677; 62 -2.75,5.677; 63 -3.25,5.677; 64 -3.75,5.677
SAMTEC-SMM-104-02-X-D = smd 1.02 x 2.77: 1 -3,2.273; 2 -3,-2.273; 3 -1,2.273; 4 -1,-2.273; 5 1,2.273; 6 1,-2.273; 7 3,2.273; 8 3,-2.273
SAMTEC-CLP-106-02-X-D = smd 0.74 x 1.47: 1 -3.175,1.613; 2 -3.175,-1.613; 3 -1.905,1.613; 4 -1.905,-1.613; 5 -0.635,1.613; 6 -0.635,-1.613; 7 0.635,1.613; 8 0.635,-1.613; 9 1.905,1.613; 10 1.905,-1.613; 11 3.175,1.613; 12 3.175,-1.613
MEM20510019500A = smd 1.3 x 1.4: MP1 -4.975,7.199; MP3 0.725,7.199 | smd 1 x 0.95: MP2 -3.585,7.425 | smd 1.4 x 1.9: MP4 -6.575,-5.95; MP5 6.575,-6.95 | smd 0.8 x 1.5: P1 1.915,-3.661; P2 0.815,-3.261; P3 -0.285,-3.661; P4 -1.385,-3.861; P5 -2.485,-3.661; P6 -3.585,-3.861; P7 -4.685,-3.661; P8 -5.785,-3.661
SAMTEC_TFM-140-02-L-D-WT-K = smd 0.74 x 2.92: 01 -24.765,-1.715; 02 -24.765,1.715; 03 -23.495,-1.715; 04 -23.495,1.715; 05 -22.225,-1.715; 06 -22.225,1.715; 07 -20.955,-1.715; 08 -20.955,1.715; 09 -19.685,-1.715; 10 -19.685,1.715; 11 -18.415,-1.715; 12 -18.415,1.715; 13 -17.145,-1.715; 14 -17.145,1.715; 15 -15.875,-1.715; 16 -15.875,1.715; 17 -14.605,-1.715; 18 -14.605,1.715; 19 -13.335,-1.715; 20 -13.335,1.715; 21 -12.065,-1.715; 22 -12.065,1.715; 23 -10.795,-1.715; 24 -10.795,1.715; 25 -9.525,-1.715; 26 -9.525,1.715; 27 -8.255,-1.715; 28 -8.255,1.715; 29 -6.985,-1.715; 30 -6.985,1.715; 31 -5.715,-1.715; 32 -5.715,1.715; 33 -4.445,-1.715; 34 -4.445,1.715; 35 -3.175,-1.715; 36 -3.175,1.715; 37 -1.905,-1.715; 38 -1.905,1.715; 39 -0.635,-1.715; 40 -0.635,1.715; 41 0.635,-1.715; 42 0.635,1.715; 43 1.905,-1.715; 44 1.905,1.715; 45 3.175,-1.715; 46 3.175,1.715; 47 4.445,-1.715; 48 4.445,1.715; 49 5.715,-1.715; 50 5.715,1.715; 51 6.985,-1.715; 52 6.985,1.715; 53 8.255,-1.715; 54 8.255,1.715; 55 9.525,-1.715; 56 9.525,1.715; 57 10.795,-1.715; 58 10.795,1.715; 59 12.065,-1.715; 60 12.065,1.715; 61 13.335,-1.715; 62 13.335,1.715; 63 14.605,-1.715; 64 14.605,1.715; 65 15.875,-1.715; 66 15.875,1.715; 67 17.145,-1.715; 68 17.145,1.715; 69 18.415,-1.715; 70 18.415,1.715; 71 19.685,-1.715; 72 19.685,1.715; 73 20.955,-1.715; 74 20.955,1.715; 75 22.225,-1.715; 76 22.225,1.715; 77 23.495,-1.715; 78 23.495,1.715; 79 24.765,-1.715; 80 24.765,1.715 | drill 0.84 pad 1.19: S1 27.355,0; S2 -27.355,0
SAMTEC_SSM-109-L-SV = smd 1.02 x 1.905: 01 10.16,1.603; 02 7.62,-1.603; 03 5.08,1.603; 04 2.54,-1.603; 05 0,1.603; 06 -2.54,-1.603; 07 -5.08,1.603; 08 -7.62,-1.603; 09 -10.16,1.603 | hole 7: -10.16,29.72; 10.16,29.72
LEDM168X80N = smd 1.2 x 0.75: 1 -0.8,0; 2 0.8,0
AA3021LSYSKJ3TR = smd 1.4 x 1.5: 1 -1.4,0; 2 1.4,0
APT1608CGCK = smd 0.8 x 0.8: 1 -0.825,0; 2 0.825,0
LEDM168X65N = smd 1 x 0.7: 1 -0.9,0; 2 0.9,0
ASMTURB4YU802 = smd 1.5 x 2.6: 1 -1.5,0; 2 1.5,0
TRANS_NTLUS3A18PZTAG = smd 0.43 x 0.35: 1 -0.935,0.65; 2 -0.935,0; 3 -0.935,-0.65; 4 0.935,-0.65; 5 0.935,0; 6 0.935,0.65 | smd 1.1 x 1.25: 7 0,0.285 | smd 0.66 x 0.35: 8 0,-0.775
RESC1005X40N = smd 0.75 x 0.6: 1 -0.55,0; 2 0.55,0
RESC1005X37N = smd 0.7 x 0.6: 1 -0.55,0; 2 0.55,0
ERA2A_(0402) = smd 0.475 x 0.5: 1 -0.512,0; 2 0.512,0
ERJP03_PA3_(0603) = smd 0.65 x 0.9: 1 -0.725,0; 2 0.725,0
RESC1005X35N = smd 0.7 x 0.6: 1 -0.55,0; 2 0.55,0
ERJ_2LW_2BW_2B_(0402) = smd 0.475 x 0.5: 1 -0.512,0; 2 0.512,0
ERJ2R_(0402) = smd 0.475 x 0.5: 1 -0.512,0; 2 0.512,0
RESC6432X55N = smd 3.45 x 3.45: 1 -1.95,0; 2 1.95,0
ERA2AED122X = smd 0.475 x 0.5: 1 -0.512,0; 2 0.512,0
DIP1016W60P254L914H635Q6N = drill 0.8 pad 1.2 square: 1 -5.08,2.54 | drill 0.8 pad 1.2: 2 -5.08,0; 3 -5.08,-2.54; 4 5.08,-2.54; 5 5.08,0; 6 5.08,2.54
RESC3016X70N = smd 1.131 x 1.77: 1 -1.395,0; 2 1.395,0
1/16TH_BOLT = drill 3.048 pad 6.35: 1/16IN 0,0
NUCLEO_H723ZG = drill 1.02 pad 1.37: 3V3 72.923,62.611; 3V3_VDD 85.623,65.151; 5V 70.383,62.611; 5V_EXT 85.623,62.611; 5V_USB_STLK 83.083,1.651; 10 80.543,4.191; 19 67.843,1.651; 31_AGND 52.603,1.651; 40 42.443,4.191; 53 24.663,1.651; 64 11.963,4.191; 71 1.803,1.651; 72 1.803,4.191; 79 83.083,62.611; 91 67.843,62.611; 92 67.843,65.151; 93 65.303,62.611; 122 29.743,65.151; 131 17.043,62.611; 143 1.803,62.611; 144 1.803,65.151; BOOT0 83.083,65.151; IOREF 78.003,62.611; NC_1 80.543,62.611; NC_2 60.223,62.611; NC_3 6.883,65.151; NRST 75.463,62.611; PA0 57.683,62.611; PA1 55.143,62.611; PA2 47.523,4.191; PA3 44.983,4.191; PA4 52.603,62.611; PA5 78.003,4.191; PA6 75.463,4.191; PA7 72.923,4.191; PA8 62.763,4.191; PA9 65.303,4.191; PA10 50.063,4.191; PA11 75.463,1.651; PA12 78.003,1.651; PA13 75.463,65.151; PA14 72.923,65.151; PA15 70.383,65.151; PB0 50.063,62.611; PB1 62.763,1.651; PB2 65.303,1.651; PB3 52.603,4.191; PB4 57.683,4.191; PB5 55.143,4.191; PB6 70.383,4.191; PB7 65.303,65.151; PB8 88.163,4.191; PB9 85.623,4.191; PB10 60.223,4.191; PB11 70.383,1.651; PB12 72.923,1.651; PB13 55.143,1.651; PB14 57.683,1.651; PB15 60.223,1.651; PC0 44.983,62.611; PC1 47.523,62.611; PC2 47.523,65.151; PC3 44.983,65.151; PC4 50.063,1.651; PC5 85.623,1.651; PC6 88.163,1.651; PC7 67.843,4.191; PC9 90.703,4.191; PC10 90.703,65.151; PC12 88.163,65.151; PC13 62.763,65.151; PC14 60.223,65.151; PC15 57.683,65.151; PD0 19.583,65.151; PD1 22.123,65.151; PD2 88.163,62.611; PD3 42.443,62.611; PD4 42.443,65.151; PD5 39.903,65.151; PD6 37.363,65.151; PD7 34.823,65.151; PD8 80.543,1.651; PD9 4.343,65.151; PD10 9.423,4.191; PD11 34.823,4.191; PD12 37.363,4.191; PD13 39.903,4.191; PD14 34.823,1.651; PD15 32.283,1.651; PE0 11.963,1.651; PE1 14.503,65.151; PE2 34.823,62.611; PE3 32.283,65.151; PE4 32.283,62.611; PE5 29.743,62.611; PE6 14.503,62.611; PE7 37.363,1.651; PE8 42.443,1.651; PE9 27.203,1.651; PE10 32.283,4.191; PE11 22.123,1.651; PE12 29.743,4.191; PE13 22.123,4.191; PE14 27.203,4.191; PE15 24.663,4.191; PF0 24.663,65.151; PF1 27.203,65.151; PF2 27.203,62.611; PF3 19.583,1.651; PF4 44.983,1.651; PF5 47.523,1.651; PF6 80.543,65.151; PF7 78.003,65.151; PF8 24.663,62.611; PF9 22.123,62.611; PF10 39.903,1.651; PF11 14.503,1.651; PF12 17.043,4.191; PF13 19.583,4.191; PF14 29.743,1.651; PF15 17.043,1.651; PG0 17.043,65.151; PG1 19.583,62.611; PG2 39.903,62.611; PG3 37.363,62.611; PG4 4.343,4.191; PG5 6.883,1.651; PG6 4.343,1.651; PG7 6.883,4.191; PG8 9.423,1.651; PG9 11.963,65.151; PG10 9.423,62.611; PG11 4.343,62.611; PG12 9.423,65.151; PG13 6.883,62.611; PG14 14.503,4.191; PG15 11.963,62.611; PH0 55.143,65.151; PH1 52.603,65.151; VBAT 50.063,65.151; VIN 62.763,62.611; VREFP 83.083,4.191 | drill 1.02 pad 1.37 square: PC8 90.703,1.651; PC11 90.703,62.611

## Placement (x,y rotation side)
40G_GPIO  SMALL_TP  [SMALL_TP]  43.66,22.1 0 bottom
!CS_ADC  SMALL_TP  [SMALL_TP]  87.45,41.84 270 bottom
!IMU_CS  SMALL_TP  [SMALL_TP]  33.99,96.28 0 bottom
!IMU_RST  SMALL_TP  [SMALL_TP]  41.61,96.28 0 bottom
!ISO_CS  SMALL_TP  [SMALL_TP]  66.68,37.07 270 bottom
!TEMP_CS  SMALL_TP  [SMALL_TP]  69.5,30.65 0 bottom
BUSY_ADC_1  SMALL_TP  [SMALL_TP]  76.45,60.97 0 bottom
BUSY_ADC_2  SMALL_TP  [SMALL_TP]  89.44,52.53 0 bottom
BUSY_ADC_3  SMALL_TP  [SMALL_TP]  91.07,44.3 0 bottom
C1  C3216X7R1E106K160AE  [C3216_COMMERCIAL]  57.27,62.62 180 top
C2  CGA4J3X7R1H105K125AB  [CAPC2012X145N]  87.5,51.89 270 top
C3  CGA4J3X7R1H105K125AB  [CAPC2012X145N]  85.41,51.88 270 top
C4  CGA4J3X7R1H105K125AB  [CAPC2012X145N]  95.13,70.66 270 top
C5  CGA4J3X7R1H105K125AB  [CAPC2012X145N]  84.36,55.69 180 bottom
C6  CGA4J3X7R1H105K125AB  [CAPC2012X145N]  90.97,55.58 270 bottom
C7  CGA4J3X7R1H105K125AB  [CAPC2012X145N]  58.73,57.98 180 top
C8  CGA4J3X7R1H105K125AB  [CAPC2012X145N]  58.94,65.25 180 top
C9  CGA4J3X7R1H105K125AB  [CAPC2012X145N]  58.86,67.34 180 top
C10  CGA4J3X7R1H105K125AB  [CAPC2012X145N]  75.37,56.71 180 top
C11  CGA4J3X7R1H105K125AB  [CAPC2012X145N]  61.97,65.93 0 bottom
C12  CGA4J3X7R1H105K125AB  [CAPC2012X145N]  61.96,63.68 0 bottom
C13  C3216X7R1E106K160AE  [C3216_COMMERCIAL]  56.3,60.12 180 top
C14  CGA4J3X7R1H105K125AB  [CAPC2012X145N]  92.88,26.8 90 top
C15  CGA4J3X7R1H105K125AB  [CAPC2012X145N]  62.04,60.88 0 bottom
C16  C3216X7R1E106K160AE  [C3216_COMMERCIAL]  92.72,51.11 270 top
C17  C3216X7R1E106K160AE  [C3216_COMMERCIAL]  76.77,31.87 180 top
C18  CGA4J3X7R1H105K125AB  [CAPC2012X145N]  88.16,55.65 270 bottom
C19  CGA4J3X7R1H105K125AB  [CAPC2012X145N]  77.49,29.86 180 top
C20  CGA4J3X7R1H105K125AB  [CAPC2012X145N]  77.53,36.28 180 top
C21  CGA4J3X7R1H105K125AB  [CAPC2012X145N]  77.53,38.38 180 top
C22  C3216X7R1E106K160AE  [C3216_COMMERCIAL]  90.03,51.11 270 top
C23  CGA4J3X7R1H105K125AB  [CAPC2012X145N]  80.8,32.39 0 bottom
C24  CGA4J3X7R1H105K125AB  [CAPC2012X145N]  80.84,29.81 0 bottom
C25  C3216X7R1E106K160AE  [C3216_COMMERCIAL]  76.77,34.28 180 top
C26  GRM31C5C1E474JE01L  [CAPC3216X180N]  64.18,3.34 180 top
C27  C3216X7R1E106K160AE  [C3216_COMMERCIAL]  97.93,78.84 270 top
C28  CS0402KRX7R8BB104  [CAPC1005X65N]  99.98,24.72 0 bottom
C29  CS0402KRX7R8BB104  [CAPC1005X65N]  108.54,24.69 0 bottom
C30  CS0402KRX7R8BB104  [CAPC1005X65N]  104.24,27.08 180 top
C33  GRM31C5C1E474JE01L  [CAPC3216X180N]  101.21,27.86 180 top
C34  GRM31C5C1E474JE01L  [CAPC3216X180N]  105.51,24.18 0 bottom
C35  GRM31C5C1E474JE01L  [CAPC3216X180N]  109.78,27.59 180 top
C36  GRM31C5C1E474JE01L  [CAPC3216X180N]  96.96,23.62 0 top
C37  GRM1555C1H822JE01D  [0402CAP]  20.48,56.49 180 top
C38  CGA2B2C0G1H102J050BE  [CAPC1005X55N]  55.81,14.14 0 top
C39  CS0402KRX7R8BB104  [CAPC1005X65N]  20.46,55.5 180 top
C40  CGA2B2C0G1H102J050BE  [CAPC1005X55N]  50.7,14.13 0 top
C41  GRM31C5C1E474JE01L  [CAPC3216X180N]  19.22,53.17 180 top
C42  GRM1555C1H822JE01D  [0402CAP]  34.53,55.92 270 bottom
C43  GRM1555C1H822JE01D  [0402CAP]  32.32,53.69 270 bottom
C44  GRM1555C1H822JE01D  [0402CAP]  19.72,48.83 180 top
C45  CS0402KRX7R8BB104  [CAPC1005X65N]  19.7,47.83 180 top
C46  GRM31C5C1E474JE01L  [CAPC3216X180N]  18.08,46.22 180 top
C47  C0402C103K3RAC7411  [C0402]  49.4,48.77 180 top
C48  CS0402KRX7R8BB104  [CAPC1005X65N]  51.1,50.5 0 top
C49  CS0402KRX7R8BB104  [CAPC1005X65N]  59.61,50.66 0 bottom
C50  CS0402KRX7R8BB104  [CAPC1005X65N]  53.5,49.61 0 bottom
C51  CS0402KRX7R8BB104  [CAPC1005X65N]  57.25,49.31 180 bottom
C52  CS0402KRX7R8BB104  [CAPC1005X65N]  55.36,50.67 180 bottom
C53  C0402C103K3RAC7411  [C0402]  49.6,44.41 180 top
C54  CS0402KRX7R8BB104  [CAPC1005X65N]  51.31,46.16 0 top
C55  C0402C103K3RAC7411  [C0402]  49.54,35.77 180 top
C56  CS0402KRX7R8BB104  [CAPC1005X65N]  51.26,37.51 0 top
C57  CS0402KRX7R8BB104  [CAPC1005X65N]  54.91,28.82 0 bottom
C58  CS0402KRX7R8BB104  [CAPC1005X65N]  53.14,36.37 0 bottom
C59  CS0402KRX7R8BB104  [CAPC1005X65N]  57.43,31.95 180 bottom
C60  CS0402KRX7R8BB104  [CAPC1005X65N]  59.77,37.69 180 bottom
C61  C0402C103K3RAC7411  [C0402]  49.58,31.38 180 top
C62  CS0402KRX7R8BB104  [CAPC1005X65N]  51.3,33.12 0 top
C63  CGA2B2C0G1H102J050BE  [CAPC1005X55N]  49.59,6.73 0 top
C64  CGA2B2C0G1H102J050BE  [CAPC1005X55N]  54.67,6.74 0 top
C65  GRM31C5C1E474JE01L  [CAPC3216X180N]  102.25,27.29 90 bottom
C66  CGA2B2C0G1H102J050BE  [CAPC1005X55N]  60.46,14.14 0 top
C67  CGA2B2C0G1H102J050BE  [CAPC1005X55N]  64.26,14.05 90 top
C68  CGA2B2C0G1H102J050BE  [CAPC1005X55N]  59.92,6.77 0 top
C69  CGA2B2C0G1H102J050BE  [CAPC1005X55N]  64.25,8.44 0 top
C70  GRM31C5C1E474JE01L  [CAPC3216X180N]  106.48,24.47 270 top
C71  GRM31C5C1E474JE01L  [CAPC3216X180N]  96.97,25.74 0 top
C72  GRM31C5C1E474JE01L  [CAPC3216X180N]  100.13,27.29 90 bottom
C73  GRM31C5C1E474JE01L  [CAPC3216X180N]  104.36,24.47 270 top
C74  CS0402KRX7R8BB104  [CAPC1005X65N]  55.5,41.98 0 bottom
C75  CS0402KRX7R8BB104  [CAPC1005X65N]  53.13,40.65 0 bottom
C76  CS0402KRX7R8BB104  [CAPC1005X65N]  53.18,44.98 180 bottom
C77  CS0402KRX7R8BB104  [CAPC1005X65N]  59.81,46.31 180 bottom
C78  C0402C103K3RAC7411  [C0402]  49.53,40.07 180 top
C79  CS0402KRX7R8BB104  [CAPC1005X65N]  51.26,41.81 0 top
C80  CS0402KRX7R8BB104  [CAPC1005X65N]  55.56,46.31 0 bottom
C81  CS0402KRX7R8BB104  [CAPC1005X65N]  57.44,44.99 0 bottom
C82  CS0402KRX7R8BB104  [CAPC1005X65N]  55.51,37.68 0 bottom
C83  CS0402KRX7R8BB104  [CAPC1005X65N]  48.28,27.48 0 bottom
C84  CS0402KRX7R8BB104  [CAPC1005X65N]  57.4,36.35 180 bottom
C85  CS0402KRX7R8BB104  [CAPC1005X65N]  50.65,28.82 180 bottom
C86  C0402C103K3RAC7411  [C0402]  44.68,26.91 180 top
C87  CS0402KRX7R8BB104  [CAPC1005X65N]  46.4,28.65 0 top
C88  CS0402KRX7R8BB104  [CAPC1005X65N]  55.56,33.29 0 bottom
C89  CS0402KRX7R8BB104  [CAPC1005X65N]  52.53,27.48 0 bottom
C95  GRM1555C1H822JE01D  [0402CAP]  33.62,48.42 90 bottom
C96  C3216X7R1E106K160AE  [C3216_COMMERCIAL]  106.06,78.76 270 top
C97  GRM1555C1H822JE01D  [0402CAP]  31.4,46.38 270 bottom
C98  C3216X7R1E106K160AE  [C3216_COMMERCIAL]  66.79,2.76 180 bottom
C99  GRM1555C1H822JE01D  [0402CAP]  140.32,28.46 0 top
C100  C3216X7R1E106K160AE  [C3216_COMMERCIAL]  72.28,8 0 bottom
C101  CS0402KRX7R8BB104  [CAPC1005X65N]  140.34,29.42 0 top
C102  C3216X7R1E106K160AE  [C3216_COMMERCIAL]  31.64,99.31 270 top
C103  C3216X7R1E106K160AE  [C3216_COMMERCIAL]  39.93,99.13 270 top
C104  C3216X7R1E106K160AE  [C3216_COMMERCIAL]  85.82,21.09 270 top
C105  C3216X7R1E106K160AE  [C3216_COMMERCIAL]  75.46,16.27 0 top
C106  C3216X7R1E106K160AE  [C3216_COMMERCIAL]  79.7,21.65 270 bottom
C107  GRM31C5C1E474JE01L  [CAPC3216X180N]  141.46,30.97 0 top
C108  C3216X7R1E106K160AE  [C3216_COMMERCIAL]  75.2,21.72 270 bottom
C109  C3216X7R1E106K160AE  [C3216_COMMERCIAL]  83.97,21.16 270 bottom
C110  C3216X7R1E106K160AE  [C3216_COMMERCIAL]  75.12,12.07 180 bottom
C111  GRT21BC8YA475KE13K  [CAPC2012X135N]  88.8,11.99 90 bottom
C112  GRM1555C1H822JE01D  [0402CAP]  125.71,29.23 270 bottom
C113  GRM1555C1H822JE01D  [0402CAP]  127.92,31.31 90 bottom
C114  GRM1555C1H822JE01D  [0402CAP]  140.69,36.06 0 top
C115  CS0402KRX7R8BB104  [CAPC1005X65N]  140.72,37.01 0 top
C116  GRM31C5C1E474JE01L  [CAPC3216X180N]  141.83,38.55 0 top
C117  GRM1555C1H822JE01D  [0402CAP]  125.74,36.84 270 bottom
C118  GRM1555C1H822JE01D  [0402CAP]  127.93,38.83 90 bottom
C119  GRM1555C1H822JE01D  [0402CAP]  141.11,6.29 0 top
C120  CS0402KRX7R8BB104  [CAPC1005X65N]  141.14,7.24 0 top
C121  GRM31C5C1E474JE01L  [CAPC3216X180N]  142.27,8.76 0 top
C122  GRM1555C1H822JE01D  [0402CAP]  125.83,6.82 270 bottom
C123  GRM1555C1H822JE01D  [0402CAP]  127.99,9 90 bottom
C124  GRM1555C1H822JE01D  [0402CAP]  141.21,14.08 0 top
C125  CS0402KRX7R8BB104  [CAPC1005X65N]  141.25,15.02 0 top
C126  GRM31C5C1E474JE01L  [CAPC3216X180N]  142.37,16.56 0 top
C127  GRM1555C1H822JE01D  [0402CAP]  125.7,14.4 270 bottom
C128  GRM1555C1H822JE01D  [0402CAP]  127.92,16.46 90 bottom
C129  GRM1555C1H822JE01D  [0402CAP]  141,21.35 0 top
C130  CS0402KRX7R8BB104  [CAPC1005X65N]  141.03,22.31 0 top
C131  GRM31C5C1E474JE01L  [CAPC3216X180N]  142.16,23.85 0 top
C132  GRM1555C1H822JE01D  [0402CAP]  125.79,21.92 270 bottom
C133  GRM1555C1H822JE01D  [0402CAP]  127.99,23.97 90 bottom
C134  GRM1555C1H822JE01D  [0402CAP]  19.71,23.84 180 top
C135  CS0402KRX7R8BB104  [CAPC1005X65N]  19.69,22.88 180 top
C136  GRM31C5C1E474JE01L  [CAPC3216X180N]  18.57,21.34 180 top
C137  GRM1555C1H822JE01D  [0402CAP]  34.61,23.35 90 bottom
C138  GRM1555C1H822JE01D  [0402CAP]  32.41,21.25 270 bottom
C139  GRM1555C1H822JE01D  [0402CAP]  140.88,43.58 0 top
C140  CS0402KRX7R8BB104  [CAPC1005X65N]  140.92,44.52 0 top
C141  GRM31C5C1E474JE01L  [CAPC3216X180N]  142.03,46.05 0 top
C142  GRM1555C1H822JE01D  [0402CAP]  125.58,44.23 270 bottom
C143  GRM1555C1H822JE01D  [0402CAP]  127.77,46.26 90 bottom
C144  GRM1555C1H822JE01D  [0402CAP]  140.9,51.31 0 top
C145  CS0402KRX7R8BB104  [CAPC1005X65N]  140.94,52.27 0 top
C146  GRM31C5C1E474JE01L  [CAPC3216X180N]  142.07,53.81 0 top
C147  GRM1555C1H822JE01D  [0402CAP]  125.6,51.65 270 bottom
C148  GRM1555C1H822JE01D  [0402CAP]  127.78,53.75 90 bottom
C149  GRM1555C1H822JE01D  [0402CAP]  18.88,40.87 180 top
C150  CS0402KRX7R8BB104  [CAPC1005X65N]  18.82,39.89 180 top
C151  GRM31C5C1E474JE01L  [CAPC3216X180N]  17.69,38.27 180 top
C152  GRM1555C1H822JE01D  [0402CAP]  33.53,40.18 90 bottom
C153  GRM1555C1H822JE01D  [0402CAP]  31.34,38.14 270 bottom
C154  GRM1555C1H822JE01D  [0402CAP]  19.05,33.18 180 top
C155  CS0402KRX7R8BB104  [CAPC1005X65N]  19.08,32.23 180 top
C156  GRM31C5C1E474JE01L  [CAPC3216X180N]  17.96,30.67 180 top
C157  GRM1555C1H822JE01D  [0402CAP]  33.59,32.68 90 bottom
C158  GRM1555C1H822JE01D  [0402CAP]  31.37,30.61 270 bottom
C159  GRM1555C1H822JE01D  [0402CAP]  19.53,15.85 180 top
C160  CS0402KRX7R8BB104  [CAPC1005X65N]  19.49,14.88 180 top
C161  GRM31C5C1E474JE01L  [CAPC3216X180N]  18.37,13.33 180 top
C162  GRM1555C1H822JE01D  [0402CAP]  34.54,15.53 90 bottom
C163  GRM1555C1H822JE01D  [0402CAP]  32.36,13.57 270 bottom
C164  GRM1555C1H822JE01D  [0402CAP]  19.42,8.5 180 top
C165  CS0402KRX7R8BB104  [CAPC1005X65N]  19.39,7.55 180 top
C166  GRM31C5C1E474JE01L  [CAPC3216X180N]  18.27,6 180 top
C167  GRM1555C1H822JE01D  [0402CAP]  34.33,8.23 90 bottom
C168  GRM1555C1H822JE01D  [0402CAP]  32.14,6.09 270 bottom
C169  GRM31C5C1E474JE01L  [CAPC3216X180N]  22.14,85.53 90 bottom
C170  GRM31C5C1E474JE01L  [CAPC3216X180N]  65.86,29.74 270 top
C171  06035C270JAT2A  [CAPC1608X90N]  70.47,19.96 0 top
C172  06035C270JAT2A  [CAPC1608X90N]  55.29,19.92 180 top
C173  CGA4J3X7R1H105K125AB  [CAPC2012X145N]  89.99,1.91 0 bottom
C174  CGA4J3X7R1H105K125AB  [CAPC2012X145N]  91.53,12.12 90 bottom
C175  C0402C103K3RAC7411  [C0402]  40.22,63.63 0 top
C176  CS0402KRX7R8BB104  [CAPC1005X65N]  38.51,61.87 180 top
C177  CS0402KRX7R8BB104  [CAPC1005X65N]  30,61.74 180 bottom
C178  CS0402KRX7R8BB104  [CAPC1005X65N]  32.34,63.05 180 bottom
C179  CS0402KRX7R8BB104  [CAPC1005X65N]  36.63,63.12 0 bottom
C180  CS0402KRX7R8BB104  [CAPC1005X65N]  34.25,61.73 0 bottom
C181  C0402C103K3RAC7411  [C0402]  49.24,53.17 180 top
C182  CS0402KRX7R8BB104  [CAPC1005X65N]  50.95,54.91 0 top
C183  CS0402KRX7R8BB104  [CAPC1005X65N]  55.19,55.08 0 bottom
C184  CS0402KRX7R8BB104  [CAPC1005X65N]  57.07,53.75 0 bottom
C185  CS0402KRX7R8BB104  [CAPC1005X65N]  52.84,53.78 180 bottom
C186  CS0402KRX7R8BB104  [CAPC1005X65N]  59.45,55.08 180 bottom
C187  CS0402KRX7R8BB104  [CAPC1005X65N]  57.39,40.62 180 bottom
C188  CS0402KRX7R8BB104  [CAPC1005X65N]  59.77,41.98 180 bottom
C189  GRM31C5C1E474JE01L  [CAPC3216X180N]  80.04,2.07 180 top
C190  CGA4J3X7R1H105K125AB  [CAPC2012X145N]  95.23,51.74 270 top
C191  GRM31C5C1E474JE01L  [CAPC3216X180N]  95.14,5.91 270 top
C192  GRM31C5C1E474JE01L  [CAPC3216X180N]  90.49,19.31 0 top
C193  GRM31C5C1E474JE01L  [CAPC3216X180N]  122.8,104.66 90 top
C194  GRM31C5C1E474JE01L  [CAPC3216X180N]  25.86,72.87 270 top
C195  GRM31C5C1E474JE01L  [CAPC3216X180N]  80.24,44.08 270 top
C196  CGA4J3X7R1H105K125AB  [CAPC2012X145N]  80.77,35.72 0 bottom
C197  CS0402KRX7R8BB104  [CAPC1005X65N]  53.19,32 180 bottom
C198  CS0402KRX7R8BB104  [CAPC1005X65N]  59.81,33.29 180 bottom
C199  C0402C103K3RAC7411  [C0402]  110.24,32.02 0 top
C200  CS0402KRX7R8BB104  [CAPC1005X65N]  108.51,30.26 180 top
C201  CS0402KRX7R8BB104  [CAPC1005X65N]  99.99,47.33 180 bottom
C202  CS0402KRX7R8BB104  [CAPC1005X65N]  102.35,40.05 180 bottom
C203  CS0402KRX7R8BB104  [CAPC1005X65N]  106.62,35.76 0 bottom
C204  CS0402KRX7R8BB104  [CAPC1005X65N]  104.23,47.32 0 bottom
C205  C0402C103K3RAC7411  [C0402]  110.23,36.33 0 top
C206  CS0402KRX7R8BB104  [CAPC1005X65N]  108.49,34.6 180 top
C207  CS0402KRX7R8BB104  [CAPC1005X65N]  104.25,34.43 180 bottom
C208  CS0402KRX7R8BB104  [CAPC1005X65N]  102.35,48.66 180 bottom
C209  CS0402KRX7R8BB104  [CAPC1005X65N]  106.6,40.05 0 bottom
C210  CS0402KRX7R8BB104  [CAPC1005X65N]  100,34.44 0 bottom
C211  C0402C103K3RAC7411  [C0402]  110.19,40.62 0 top
C212  CS0402KRX7R8BB104  [CAPC1005X65N]  108.47,38.87 180 top
C213  CS0402KRX7R8BB104  [CAPC1005X65N]  104.23,38.71 180 bottom
C214  CS0402KRX7R8BB104  [CAPC1005X65N]  102.37,35.77 180 bottom
C215  CS0402KRX7R8BB104  [CAPC1005X65N]  106.61,48.66 0 bottom
C216  CS0402KRX7R8BB104  [CAPC1005X65N]  104.28,30.11 0 bottom
C217  C0402C103K3RAC7411  [C0402]  110.19,44.91 0 top
C218  CS0402KRX7R8BB104  [CAPC1005X65N]  108.47,43.18 180 top
C219  CS0402KRX7R8BB104  [CAPC1005X65N]  136.88,60.11 0 bottom
C220  CS0402KRX7R8BB104  [CAPC1005X65N]  106.65,31.42 180 bottom
C221  CS0402KRX7R8BB104  [CAPC1005X65N]  106.61,52.99 0 bottom
C222  CS0402KRX7R8BB104  [CAPC1005X65N]  132.64,60.1 180 bottom
C223  C0402C103K3RAC7411  [C0402]  110.19,49.24 0 top
C224  CS0402KRX7R8BB104  [CAPC1005X65N]  108.48,47.5 180 top
C225  CS0402KRX7R8BB104  [CAPC1005X65N]  104.24,51.66 180 bottom
C226  CS0402KRX7R8BB104  [CAPC1005X65N]  130.25,58.78 0 bottom
C227  CS0402KRX7R8BB104  [CAPC1005X65N]  102.4,31.45 0 bottom
C228  CS0402KRX7R8BB104  [CAPC1005X65N]  99.99,51.66 0 bottom
C229  C0402C103K3RAC7411  [C0402]  110.2,53.55 0 top
C230  CS0402KRX7R8BB104  [CAPC1005X65N]  108.48,51.82 180 top
C231  CS0402KRX7R8BB104  [CAPC1005X65N]  100.03,30.1 180 bottom
C232  CS0402KRX7R8BB104  [CAPC1005X65N]  102.35,53 180 bottom
C233  CS0402KRX7R8BB104  [CAPC1005X65N]  134.52,58.75 180 bottom
C234  CS0402KRX7R8BB104  [CAPC1005X65N]  99.97,43.01 0 bottom
C235  C0402C103K3RAC7411  [C0402]  126.67,58.2 180 top
C236  CS0402KRX7R8BB104  [CAPC1005X65N]  128.41,59.93 0 top
C237  CS0402KRX7R8BB104  [CAPC1005X65N]  99.99,38.71 180 bottom
C238  CS0402KRX7R8BB104  [CAPC1005X65N]  102.34,44.35 180 bottom
C239  CS0402KRX7R8BB104  [CAPC1005X65N]  128.95,63.1 180 bottom
C240  CS0402KRX7R8BB104  [CAPC1005X65N]  104.22,43.01 0 bottom
C241  C0402C103K3RAC7411  [C0402]  125.37,62.55 180 top
C242  CS0402KRX7R8BB104  [CAPC1005X65N]  127.06,64.27 0 top
C243  CS0402KRX7R8BB104  [CAPC1005X65N]  131.31,64.46 0 bottom
C244  CS0402KRX7R8BB104  [CAPC1005X65N]  106.59,44.34 180 bottom
C245  CS0402KRX7R8BB104  [CAPC1005X65N]  133.21,63.09 180 bottom
C246  CS0402KRX7R8BB104  [CAPC1005X65N]  135.56,64.45 180 bottom
C247  C0402C103K3RAC7411  [C0402]  114.63,3.86 0 top
C248  CS0402KRX7R8BB104  [CAPC1005X65N]  112.9,2.13 180 top
C249  CS0402KRX7R8BB104  [CAPC1005X65N]  108.66,1.95 180 bottom
C250  CS0402KRX7R8BB104  [CAPC1005X65N]  111.03,3.28 180 bottom
C251  CS0402KRX7R8BB104  [CAPC1005X65N]  106.78,3.28 0 bottom
C252  CS0402KRX7R8BB104  [CAPC1005X65N]  104.42,1.95 0 bottom
C253  C0402C103K3RAC7411  [C0402]  110.2,8.19 0 top
C254  CS0402KRX7R8BB104  [CAPC1005X65N]  108.47,6.46 180 top
C255  CS0402KRX7R8BB104  [CAPC1005X65N]  104.22,6.28 180 bottom
C256  CS0402KRX7R8BB104  [CAPC1005X65N]  102.33,7.62 180 bottom
C257  CS0402KRX7R8BB104  [CAPC1005X65N]  106.6,7.61 0 bottom
C258  CS0402KRX7R8BB104  [CAPC1005X65N]  99.97,6.27 0 bottom
C259  C0402C103K3RAC7411  [C0402]  110.23,12.48 0 top
C260  CS0402KRX7R8BB104  [CAPC1005X65N]  108.5,10.75 180 top
C261  CS0402KRX7R8BB104  [CAPC1005X65N]  104.24,10.58 180 bottom
C262  CS0402KRX7R8BB104  [CAPC1005X65N]  106.63,11.92 180 bottom
C263  CS0402KRX7R8BB104  [CAPC1005X65N]  106.57,16.18 0 bottom
C264  CS0402KRX7R8BB104  [CAPC1005X65N]  100,10.58 0 bottom
C265  C0402C103K3RAC7411  [C0402]  110.17,16.74 0 top
C266  CS0402KRX7R8BB104  [CAPC1005X65N]  108.45,15.01 180 top
C267  CS0402KRX7R8BB104  [CAPC1005X65N]  104.19,14.86 180 bottom
C268  CS0402KRX7R8BB104  [CAPC1005X65N]  102.32,16.17 180 bottom
C269  CS0402KRX7R8BB104  [CAPC1005X65N]  102.36,11.93 0 bottom
C270  CS0402KRX7R8BB104  [CAPC1005X65N]  99.94,14.85 0 bottom
C271  C0402C103K3RAC7411  [C0402]  110.17,21.1 0 top
C272  CS0402KRX7R8BB104  [CAPC1005X65N]  108.44,19.35 180 top
C273  CS0402KRX7R8BB104  [CAPC1005X65N]  99.95,19.2 180 bottom
C274  CS0402KRX7R8BB104  [CAPC1005X65N]  102.32,20.52 180 bottom
C275  CS0402KRX7R8BB104  [CAPC1005X65N]  106.57,20.53 0 bottom
C276  CS0402KRX7R8BB104  [CAPC1005X65N]  104.2,19.19 0 bottom
CD/DAT3_SPI-CS  SMALL_TP  [SMALL_TP]  77.05,129.46 0 bottom
CLK  SMALL_TP  [SMALL_TP]  74.51,129.46 0 bottom
CMD_SPI-DI  SMALL_TP  [SMALL_TP]  79.59,129.46 0 bottom
CONVAB_ADC  SMALL_TP  [SMALL_TP]  87.45,36.76 270 bottom
D1  PTVS12VS1UR,115  [SOD123W]  44.91,53.78 180 bottom
D2  PTVS12VS1UR,115  [SOD123W]  44.9,55.07 0 top
D3  PTVS12VS1UR,115  [SOD123W]  33.35,59.58 180 top
D4  PTVS12VS1UR,115  [SOD123W]  44.93,49.98 0 top
D5  PTVS12VS1UR,115  [SOD123W]  44.92,51.25 180 bottom
D6  PTVS12VS1UR,115  [SOD123W]  44.92,52.51 0 top
D7  PTVS12VS1UR,115  [SOD123W]  44.92,47.44 0 top
D8  PTVS12VS1UR,115  [SOD123W]  44.93,48.72 180 bottom
D9  PTVS12VS1UR,115  [SOD123W]  39.18,50.72 180 bottom
D10  PTVS12VS1UR,115  [SOD123W]  44.93,43.61 180 bottom
D11  PTVS12VS1UR,115  [SOD123W]  44.93,44.9 0 top
D12  PTVS12VS1UR,115  [SOD123W]  44.93,46.18 180 bottom
D13  PTVS12VS1UR,115  [SOD123W]  114.75,33.07 0 bottom
D14  PTVS12VS1UR,115  [SOD123W]  114.75,31.8 180 top
D15  PTVS12VS1UR,115  [SOD123W]  121.39,34.2 0 bottom
D16  PTVS12VS1UR,115  [SOD123W]  114.73,36.88 180 top
D17  PTVS12VS1UR,115  [SOD123W]  114.73,35.6 0 bottom
D18  PTVS12VS1UR,115  [SOD123W]  114.74,34.33 180 top
D19  PTVS12VS1UR,115  [SOD123W]  114.72,39.41 180 top
D20  PTVS12VS1UR,115  [SOD123W]  114.74,38.14 0 bottom
D21  PTVS12VS1UR,115  [SOD123W]  121.64,41.44 0 bottom
D22  PTVS12VS1UR,115  [SOD123W]  114.69,43.21 0 bottom
D23  PTVS12VS1UR,115  [SOD123W]  114.69,41.95 180 top
D24  PTVS12VS1UR,115  [SOD123W]  114.72,40.67 0 bottom
D25  PTVS12VS1UR,115  [SOD123W]  114.71,7.67 0 bottom
D26  PTVS12VS1UR,115  [SOD123W]  114.71,6.41 180 top
D27  PTVS12VS1UR,115  [SOD123W]  125.62,3.15 270 top
D28  PTVS12VS1UR,115  [SOD123W]  114.7,11.47 180 top
D29  PTVS12VS1UR,115  [SOD123W]  114.7,10.23 0 bottom
D30  PTVS12VS1UR,115  [SOD123W]  114.7,8.93 180 top
D31  PTVS12VS1UR,115  [SOD123W]  114.71,14.02 180 top
D32  PTVS12VS1UR,115  [SOD123W]  114.7,12.73 0 bottom
D33  PTVS12VS1UR,115  [SOD123W]  122.31,11.55 0 bottom
D34  PTVS12VS1UR,115  [SOD123W]  114.7,17.81 0 bottom
D35  PTVS12VS1UR,115  [SOD123W]  114.71,16.54 180 top
D36  PTVS12VS1UR,115  [SOD123W]  114.71,15.28 0 bottom
D37  PTVS12VS1UR,115  [SOD123W]  114.7,20.31 0 bottom
D38  PTVS12VS1UR,115  [SOD123W]  114.7,19.05 180 top
D39  PTVS12VS1UR,115  [SOD123W]  121.26,19.46 0 bottom
D40  PTVS12VS1UR,115  [SOD123W]  114.72,24.15 180 top
D41  PTVS12VS1UR,115  [SOD123W]  114.71,22.89 0 bottom
D42  PTVS12VS1UR,115  [SOD123W]  114.7,21.61 180 top
D43  PTVS12VS1UR,115  [SOD123W]  44.91,8.18 0 top
D44  PTVS12VS1UR,115  [SOD123W]  44.92,9.34 180 bottom
D45  RSR025N03HZGTL  [SOT95P280X100-3N]  49.86,11.56 90 top
D46  PTVS12VS1UR,115  [SOD123W]  44.89,5.52 0 top
D47  PTVS12VS1UR,115  [SOD123W]  44.89,6.81 180 bottom
D48  RSR025N03HZGTL  [SOT95P280X100-3N]  54.96,11.59 90 top
D49  PTVS12VS1UR,115  [SOD123W]  114.68,45.76 0 bottom
D50  PTVS12VS1UR,115  [SOD123W]  114.69,44.49 180 top
D51  PTVS12VS1UR,115  [SOD123W]  121.38,48.8 0 bottom
D52  PTVS12VS1UR,115  [SOD123W]  114.68,49.57 180 top
D53  PTVS12VS1UR,115  [SOD123W]  114.68,48.3 0 bottom
D54  PTVS12VS1UR,115  [SOD123W]  114.68,47.02 180 top
D55  PTVS12VS1UR,115  [SOD123W]  114.68,52.12 180 top
D56  PTVS12VS1UR,115  [SOD123W]  114.68,50.85 0 bottom
D57  PTVS12VS1UR,115  [SOD123W]  121.48,55.74 0 bottom
D58  PTVS12VS1UR,115  [SOD123W]  114.68,55.92 0 bottom
D59  PTVS12VS1UR,115  [SOD123W]  114.69,54.65 180 top
D60  PTVS12VS1UR,115  [SOD123W]  114.69,53.39 0 bottom
D61  PTVS12VS1UR,115  [SOD123W]  44.94,41.09 180 bottom
D62  PTVS12VS1UR,115  [SOD123W]  44.94,42.36 0 top
D63  PTVS12VS1UR,115  [SOD123W]  38.82,42.32 180 bottom
D64  PTVS12VS1UR,115  [SOD123W]  44.95,37.28 0 top
D65  PTVS12VS1UR,115  [SOD123W]  44.94,38.55 180 bottom
D66  PTVS12VS1UR,115  [SOD123W]  44.94,39.82 0 top
D67  PTVS12VS1UR,115  [SOD123W]  44.98,34.74 0 top
D68  PTVS12VS1UR,115  [SOD123W]  44.98,35.99 180 bottom
D69  PTVS12VS1UR,115  [SOD123W]  38.69,35.42 180 bottom
D70  PTVS12VS1UR,115  [SOD123W]  44.97,30.94 180 bottom
D71  PTVS12VS1UR,115  [SOD123W]  44.97,32.21 0 top
D72  PTVS12VS1UR,115  [SOD123W]  44.97,33.47 180 bottom
D73  PTVS12VS1UR,115  [SOD123W]  44.9,13.14 0 top
D74  PTVS12VS1UR,115  [SOD123W]  44.9,14.42 180 bottom
D75  RSR025N03HZGTL  [SOT95P280X100-3N]  48.75,4.17 90 top
D76  PTVS12VS1UR,115  [SOD123W]  44.91,10.61 0 top
D77  PTVS12VS1UR,115  [SOD123W]  44.91,11.88 180 bottom
D78  RSR025N03HZGTL  [SOT95P280X100-3N]  53.82,4.18 90 top
D79  RSR025N03HZGTL  [SOT95P280X100-3N]  59.61,11.57 90 top
D80  RSR025N03HZGTL  [SOT95P280X100-3N]  66.87,13.26 180 top
D81  RSR025N03HZGTL  [SOT95P280X100-3N]  59.08,4.2 90 top
D82  RSR025N03HZGTL  [SOT95P280X100-3N]  63.06,6.23 180 top
D84  RSR025N03HZGTL  [SOT95P280X100-3N]  133.22,98 270 top
D85  RSR025N03HZGTL  [SOT95P280X100-3N]  129.7,97.99 270 top
D86  RSR025N03HZGTL  [SOT95P280X100-3N]  126.21,97.98 270 top
D87  RSR025N03HZGTL  [SOT95P280X100-3N]  122.72,97.98 270 top
DAT1  SMALL_TP  [SMALL_TP]  84.67,129.46 0 bottom
DAT2  SMALL_TP  [SMALL_TP]  87.21,129.46 0 bottom
DAT_SPI-DO  SMALL_TP  [SMALL_TP]  82.13,129.46 0 bottom
DIN1  SMALL_TP  [SMALL_TP]  48.73,13.34 0 bottom
DIN2  SMALL_TP  [SMALL_TP]  55.3,13.34 0 bottom
DIN3  SMALL_TP  [SMALL_TP]  45.65,3.44 0 bottom
DIN4  SMALL_TP  [SMALL_TP]  53.63,5.24 0 bottom
DIN5  SMALL_TP  [SMALL_TP]  59.56,13.34 0 bottom
DIN6  SMALL_TP  [SMALL_TP]  64.71,14.31 0 bottom
DIN7  SMALL_TP  [SMALL_TP]  57.64,3.4 0 bottom
DIN8  SMALL_TP  [SMALL_TP]  63.82,4.84 0 bottom
DOUTA_ADC_1  SMALL_TP  [SMALL_TP]  68.83,60.97 0 bottom
DOUTA_ADC_2  SMALL_TP  [SMALL_TP]  81.82,52.53 0 bottom
DOUTA_ADC_3  SMALL_TP  [SMALL_TP]  83.45,44.3 0 bottom
DOUTB_ADC_1  SMALL_TP  [SMALL_TP]  71.37,60.97 0 bottom
DOUTB_ADC_2  SMALL_TP  [SMALL_TP]  84.36,52.53 0 bottom
DOUTB_ADC_3  SMALL_TP  [SMALL_TP]  85.99,44.3 0 bottom
FSTD_ADC_1  SMALL_TP  [SMALL_TP]  73.91,60.97 0 bottom
FSTD_ADC_2  SMALL_TP  [SMALL_TP]  86.9,52.53 0 bottom
FSTD_ADC_3  SMALL_TP  [SMALL_TP]  88.53,44.3 0 bottom
GPS_EN  SMALL_TP  [SMALL_TP]  74.59,114.3 0 bottom
GPS_RX  SMALL_TP  [SMALL_TP]  77.13,114.3 0 bottom
GPS_TX  SMALL_TP  [SMALL_TP]  79.67,114.3 0 bottom
IC1  NCS21911SN2T1G  [SOT95P275X110-5N]  101.15,24.98 0 top
IC2  NCS21911SN2T1G  [SOT95P275X110-5N]  105.44,27.07 180 bottom
IC3  NCS21911SN2T1G  [SOT95P275X110-5N]  109.71,24.7 0 top
IC4  LTC4222CUH#PBF  [QFN50P500X500X80-33T345N]  24.9,54.96 0 top
IC5  LP38692SDX-5.0_NOPB  [SON95P300X300X80-7N]  102.07,77.58 0 top
IC6  LP38692SDX-5.0_NOPB  [SON95P300X300X80-7N]  72.15,4.15 180 bottom
IC7  LDL1117S33R  [SOT230P700X180-4N]  82.62,13.97 0 bottom
IC8  LDL1117S33R  [SOT230P700X180-4N]  77.42,22.08 0 top
IC9  LP38692SDX-5.0_NOPB  [SON95P300X300X80-7N]  35.78,98.42 0 top
IC10  LDL1117S33R  [SOT230P700X180-4N]  83.54,14.19 180 top
IC11  LTC4222CUH#PBF  [QFN50P500X500X80-33T345N]  23.94,47.22 0 top
IC12  LTC4222CUH#PBF  [QFN50P500X500X80-33T345N]  134.92,30.39 180 top
IC13  LTC4222CUH#PBF  [QFN50P500X500X80-33T345N]  135.06,37.9 180 top
IC14  LTC4222CUH#PBF  [QFN50P500X500X80-33T345N]  135.28,7.96 180 top
IC15  LTC4222CUH#PBF  [QFN50P500X500X80-33T345N]  135.25,15.53 180 top
IC16  LTC4222CUH#PBF  [QFN50P500X500X80-33T345N]  135.31,22.89 180 top
IC17  LTC4222CUH#PBF  [QFN50P500X500X80-33T345N]  24.58,22.31 0 top
IC18  LTC4222CUH#PBF  [QFN50P500X500X80-33T345N]  135.12,45.24 180 top
IC19  LTC4222CUH#PBF  [QFN50P500X500X80-33T345N]  135.26,52.84 180 top
IC20  LTC4222CUH#PBF  [QFN50P500X500X80-33T345N]  23.84,39.27 0 top
IC21  LTC4222CUH#PBF  [QFN50P500X500X80-33T345N]  23.86,31.63 0 top
IC22  LTC4222CUH#PBF  [QFN50P500X500X80-33T345N]  24.44,14.53 0 top
IC23  LTC4222CUH#PBF  [QFN50P500X500X80-33T345N]  24.3,6.84 0 top
IC24  NCS21911SN2T1G  [SOT95P275X110-5N]  69.09,6 180 top
IC25  NCS21911SN2T1G  [SOT95P275X110-5N]  91.91,5.89 0 top
IC26  NCS21911SN2T1G  [SOT95P275X110-5N]  80.26,3.48 270 bottom
IC27  NCS21911SN2T1G  [SOT95P275X110-5N]  77.04,43.86 0 top
IC28  NCS21911SN2T1G  [SOT95P275X110-5N]  29.07,73.09 180 top
IC29  NCS21911SN2T1G  [SOT95P275X110-5N]  125.99,104.43 180 top
IC30  NCS21911SN2T1G  [SOT95P275X110-5N]  90.73,16.11 90 top
IC31  ADIS16500AMLZ  [BGA100C127P10X10_1500X1500X608]  32.77,85.77 90 bottom
IC32  LTC6820IUD#PBF  [QFN50P300X300X80-17N]  69.06,29.67 270 top
IC33  CBTL01023GM,115  [QFN50P200X155X50-10N]  49.17,19.78 180 top
IC34  MAX889TESA+  [SOIC127P600X175-8N]  90.71,6.83 90 bottom
IC35  NCS21911SN2T1G  [SOT95P275X110-5N]  35.44,63.07 180 top
IC36  NCS21911SN2T1G  [SOT95P275X110-5N]  31.17,63.08 180 top
IC37  NCS21911SN2T1G  [SOT95P275X110-5N]  54.01,53.75 0 top
IC38  ADS8588HIPM  [QFP50P1200X1200X160-64N_NO_3D]  91.43,61.74 270 top
IC39  NCS21911SN2T1G  [SOT95P275X110-5N]  58.26,53.75 0 top
IC40  NCS21911SN2T1G  [SOT95P275X110-5N]  54.17,49.34 0 top
IC41  NCS21911SN2T1G  [SOT95P275X110-5N]  58.43,49.33 0 top
IC42  NCS21911SN2T1G  [SOT95P275X110-5N]  54.37,44.98 0 top
IC43  NCS21911SN2T1G  [SOT95P275X110-5N]  58.62,44.98 0 top
IC44  NCS21911SN2T1G  [SOT95P275X110-5N]  54.32,40.64 0 top
IC45  NCS21911SN2T1G  [SOT95P275X110-5N]  58.58,40.64 0 top
IC46  NCS21911SN2T1G  [SOT95P275X110-5N]  54.33,36.35 0 top
IC47  NCS21911SN2T1G  [SOT95P275X110-5N]  58.58,36.35 0 top
IC48  NCS21911SN2T1G  [SOT95P275X110-5N]  54.37,31.96 0 top
IC49  NCS21911SN2T1G  [SOT95P275X110-5N]  58.62,31.96 0 top
IC50  NCS21911SN2T1G  [SOT95P275X110-5N]  49.47,27.48 0 top
IC51  ADS8588HIPM  [QFP50P1200X1200X160-64N_NO_3D]  68.22,62.56 180 top
IC52  ADS8588HIPM  [QFP50P1200X1200X160-64N_NO_3D]  86.75,33.14 180 top
IC53  NCS21911SN2T1G  [SOT95P275X110-5N]  53.72,27.48 0 top
IC54  NCS21911SN2T1G  [SOT95P275X110-5N]  105.46,31.44 180 top
IC55  NCS21911SN2T1G  [SOT95P275X110-5N]  101.22,31.43 180 top
IC56  NCS21911SN2T1G  [SOT95P275X110-5N]  105.43,35.76 180 top
IC57  NCS21911SN2T1G  [SOT95P275X110-5N]  101.18,35.76 180 top
IC58  NCS21911SN2T1G  [SOT95P275X110-5N]  105.41,40.05 180 top
IC59  NCS21911SN2T1G  [SOT95P275X110-5N]  101.16,40.05 180 top
IC60  NCS21911SN2T1G  [SOT95P275X110-5N]  105.41,44.35 180 top
IC61  NCS21911SN2T1G  [SOT95P275X110-5N]  101.16,44.35 180 top
IC62  NCS21911SN2T1G  [SOT95P275X110-5N]  105.41,48.66 180 top
IC63  NCS21911SN2T1G  [SOT95P275X110-5N]  101.17,48.66 180 top
IC64  NCS21911SN2T1G  [SOT95P275X110-5N]  105.43,52.99 180 top
IC65  NCS21911SN2T1G  [SOT95P275X110-5N]  101.18,52.99 180 top
IC66  NCS21911SN2T1G  [SOT95P275X110-5N]  131.45,58.77 0 top
IC67  NCS21911SN2T1G  [SOT95P275X110-5N]  135.7,58.77 0 top
IC68  NCS21911SN2T1G  [SOT95P275X110-5N]  130.12,63.11 0 top
IC69  NCS21911SN2T1G  [SOT95P275X110-5N]  134.38,63.11 0 top
IC70  NCS21911SN2T1G  [SOT95P275X110-5N]  109.84,3.28 180 top
IC71  NCS21911SN2T1G  [SOT95P275X110-5N]  105.6,3.29 180 top
IC72  NCS21911SN2T1G  [SOT95P275X110-5N]  105.41,7.62 180 top
IC73  NCS21911SN2T1G  [SOT95P275X110-5N]  101.15,7.61 180 top
IC74  NCS21911SN2T1G  [SOT95P275X110-5N]  105.44,11.91 180 top
IC75  NCS21911SN2T1G  [SOT95P275X110-5N]  101.18,11.91 180 top
IC76  NCS21911SN2T1G  [SOT95P275X110-5N]  105.39,16.18 180 top
IC77  NCS21911SN2T1G  [SOT95P275X110-5N]  101.13,16.18 180 top
IC78  NCS21911SN2T1G  [SOT95P275X110-5N]  105.38,20.53 180 top
IC79  NCS21911SN2T1G  [SOT95P275X110-5N]  101.13,20.53 180 top
IMU_DIN  SMALL_TP  [SMALL_TP]  31.45,96.28 0 bottom
IMU_DOUT  SMALL_TP  [SMALL_TP]  28.91,96.28 0 bottom
IMU_DR  SMALL_TP  [SMALL_TP]  39.07,96.28 0 bottom
IMU_SCLK  SMALL_TP  [SMALL_TP]  26.37,96.28 0 bottom
IMU_SYNC  SMALL_TP  [SMALL_TP]  36.53,96.28 0 bottom
ISO_MISO  SMALL_TP  [SMALL_TP]  66.68,42.15 270 bottom
ISO_MOSI  SMALL_TP  [SMALL_TP]  66.68,39.61 270 bottom
ISO_SPI_CH_SEL  SMALL_TP  [SMALL_TP]  58.69,27.21 0 bottom
ISO_SPI_HZ_SW  SMALL_TP  [SMALL_TP]  63.77,27.21 0 bottom
ISO_SPI_SCLK  SMALL_TP  [SMALL_TP]  66.68,34.53 270 bottom
ISO_SPI_SLOW  SMALL_TP  [SMALL_TP]  61.23,27.21 0 bottom
J1  SAMTEC-SMM-104-02-X-DJ  [SAMTEC-SMM-104-02-X-D]  120.53,82.53 90 top
J2  SAMTEC-CLP-106-02-X-DJ  [SAMTEC-CLP-106-02-X-D]  80.18,6.35 0 top
J3  MEM2051-00-195-00-A  [MEM20510019500A]  63.73,132.27 0 bottom
J4  TFM-140-02-L-D-WT-K  [SAMTEC_TFM-140-02-L-D-WT-K]  80.18,70.48 180 bottom
J5  TFM-140-02-L-D-WT-K  [SAMTEC_TFM-140-02-L-D-WT-K]  38.94,30.3 270 top
J6  TFM-140-02-L-D-WT-K  [SAMTEC_TFM-140-02-L-D-WT-K]  121.16,31.16 90 top
J9  SSM-109-L-SV  [SAMTEC_SSM-109-L-SV]  92.04,119.18 0 bottom
J12  TFM-140-02-L-D-WT-K  [SAMTEC_TFM-140-02-L-D-WT-K]  80.18,105.41 180 bottom
J14  TFM-140-02-L-D-WT-K  [SAMTEC_TFM-140-02-L-D-WT-K]  80.18,90.17 0 bottom
LED1  APHD1608LSURCK  [LEDM168X80N]  14.89,57.72 180 bottom
LED2  AA3021LSYSK_J3-TR  [AA3021LSYSKJ3TR]  29.81,55.37 90 bottom
LED3  APTD1608LCGCK  [APT1608CGCK]  14.85,56.09 0 bottom
LED4  APHD1608LSURCK  [LEDM168X80N]  14.9,52.59 180 bottom
LED5  APTD1608LCGCK  [APT1608CGCK]  14.84,54.25 0 bottom
LED6  APHD1608LSURCK  [LEDM168X80N]  13.87,50.02 180 bottom
LED7  AA3021LSYSK_J3-TR  [AA3021LSYSKJ3TR]  28.87,47.35 90 bottom
LED8  APTD1608LCGCK  [APT1608CGCK]  13.82,48.37 0 bottom
LED9  APHD1608LSURCK  [LEDM168X80N]  13.85,44.84 180 bottom
LED10  APTD1608LCGCK  [APT1608CGCK]  13.83,46.48 0 bottom
LED11  APHD1608LSURCK  [LEDM168X80N]  144.78,27.94 0 bottom
LED12  AA3021LSYSK_J3-TR  [AA3021LSYSKJ3TR]  130.42,30.27 270 bottom
LED13  APTD1608LCGCK  [APT1608CGCK]  144.84,29.59 180 bottom
LED14  APHD1608LSURCK  [LEDM168X80N]  144.78,33.13 0 bottom
LED15  APTD1608LCGCK  [APT1608CGCK]  144.83,31.46 180 bottom
LED16  APHD1608LSURCK  [LEDM168X80N]  144.82,35.34 0 bottom
LED17  AA3021LSYSK_J3-TR  [AA3021LSYSKJ3TR]  130.4,37.78 270 bottom
LED18  APTD1608LCGCK  [APT1608CGCK]  144.87,37 180 bottom
LED19  APHD1608LSURCK  [LEDM168X80N]  144.82,40.5 0 bottom
LED20  APTD1608LCGCK  [APT1608CGCK]  144.88,38.84 180 bottom
LED21  APHD1608LSURCK  [LEDM168X80N]  145.07,5.39 0 bottom
LED22  AA3021LSYSK_J3-TR  [AA3021LSYSKJ3TR]  130.48,7.91 270 bottom
LED23  APTD1608LCGCK  [APT1608CGCK]  145.11,7.04 180 bottom
LED24  APHD1608LSURCK  [LEDM168X80N]  145.06,10.58 0 bottom
LED25  APTD1608LCGCK  [APT1608CGCK]  145.11,8.92 180 bottom
LED26  APHD1608LSURCK  [LEDM168X80N]  145.01,12.9 0 bottom
LED27  AA3021LSYSK_J3-TR  [AA3021LSYSKJ3TR]  130.43,15.49 270 bottom
LED28  APTD1608LCGCK  [APT1608CGCK]  145.08,14.57 180 bottom
LED29  APHD1608LSURCK  [LEDM168X80N]  145.06,18.06 0 bottom
LED30  APTD1608LCGCK  [APT1608CGCK]  145.09,16.41 180 bottom
LED31  APHD1608LSURCK  [LEDM168X80N]  145.11,20.25 0 bottom
LED32  AA3021LSYSK_J3-TR  [AA3021LSYSKJ3TR]  130.46,22.89 270 bottom
LED33  APTD1608LCGCK  [APT1608CGCK]  145.14,21.9 180 bottom
LED34  APHD1608LSURCK  [LEDM168X80N]  145.11,25.4 0 bottom
LED35  APTD1608LCGCK  [APT1608CGCK]  145.15,23.75 180 bottom
LED36  APHD1608LSURCK  [LEDM168X80N]  15.1,24.94 180 bottom
LED37  AA3021LSYSK_J3-TR  [AA3021LSYSKJ3TR]  29.89,22.23 90 bottom
LED38  APTD1608LCGCK  [APT1608CGCK]  15.05,23.29 0 bottom
LED39  APHD1608LSURCK  [LEDM168X80N]  15.11,19.78 180 bottom
LED40  APTD1608LCGCK  [APT1608CGCK]  15.06,21.44 0 bottom
LED41  APHD1608LSURCK  [LEDM168X80N]  144.91,42.62 0 bottom
LED42  AA3021LSYSK_J3-TR  [AA3021LSYSKJ3TR]  130.26,45.18 270 bottom
LED43  APTD1608LCGCK  [APT1608CGCK]  144.96,44.28 180 bottom
LED44  APHD1608LSURCK  [LEDM168X80N]  144.9,47.77 0 bottom
LED45  APTD1608LCGCK  [APT1608CGCK]  144.96,46.12 180 bottom
LED46  APHD1608LSURCK  [LEDM168X80N]  145,50.16 0 bottom
LED47  AA3021LSYSK_J3-TR  [AA3021LSYSKJ3TR]  130.21,52.71 270 bottom
LED48  APTD1608LCGCK  [APT1608CGCK]  145.04,51.82 180 bottom
LED49  APHD1608LSURCK  [LEDM168X80N]  144.99,55.32 0 bottom
LED50  APTD1608LCGCK  [APT1608CGCK]  145.05,53.68 180 bottom
LED51  APHD1608LSURCK  [LEDM168X80N]  13.84,41.82 180 bottom
LED52  AA3021LSYSK_J3-TR  [AA3021LSYSKJ3TR]  28.85,39.22 90 bottom
LED53  APTD1608LCGCK  [APT1608CGCK]  13.78,40.17 0 bottom
LED54  APHD1608LSURCK  [LEDM168X80N]  13.84,36.63 180 bottom
LED55  APTD1608LCGCK  [APT1608CGCK]  13.78,38.29 0 bottom
LED56  APHD1608LSURCK  [LEDM168X80N]  14.13,33.96 180 bottom
LED57  AA3021LSYSK_J3-TR  [AA3021LSYSKJ3TR]  28.87,31.92 90 bottom
LED58  APTD1608LCGCK  [APT1608CGCK]  14.09,32.29 0 bottom
LED59  APHD1608LSURCK  [LEDM168X80N]  14.13,28.76 180 bottom
LED60  APTD1608LCGCK  [APT1608CGCK]  14.09,30.42 0 bottom
LED61  APHD1608LSURCK  [LEDM168X80N]  14.91,17.15 180 bottom
LED62  AA3021LSYSK_J3-TR  [AA3021LSYSKJ3TR]  29.86,14.51 90 bottom
LED63  APTD1608LCGCK  [APT1608CGCK]  14.85,15.5 0 bottom
LED64  APHD1608LSURCK  [LEDM168X80N]  14.92,12 180 bottom
LED65  APTD1608LCGCK  [APT1608CGCK]  14.86,13.65 0 bottom
LED66  APHD1608LSURCK  [LEDM168X80N]  14.77,9.4 180 bottom
LED67  AA3021LSYSK_J3-TR  [AA3021LSYSKJ3TR]  29.71,7.05 90 bottom
LED68  APTD1608LCGCK  [APT1608CGCK]  14.73,7.74 0 bottom
LED69  APHD1608LSURCK  [LEDM168X80N]  14.76,4.25 180 bottom
LED70  APTD1608LCGCK  [APT1608CGCK]  14.73,5.89 0 bottom
LED71  SMLD12BN1WT86  [LEDM168X65N]  14.36,61.31 270 bottom
LED72  SMLD12BN1WT86  [LEDM168X65N]  10.48,47.38 180 bottom
LED73  SMLD12BN1WT86  [LEDM168X65N]  10.43,39.17 180 bottom
LED74  SMLD12BN1WT86  [LEDM168X65N]  10.74,31.46 180 bottom
LED75  SMLD12BN1WT86  [LEDM168X65N]  148.16,30.48 0 bottom
LED76  SMLD12BN1WT86  [LEDM168X65N]  148.23,37.94 0 bottom
LED77  SMLD12BN1WT86  [LEDM168X65N]  148.31,45.18 0 bottom
LED78  SMLD12BN1WT86  [LEDM168X65N]  148.4,52.76 0 bottom
LED79  SMLD12BN1WT86  [LEDM168X65N]  11.71,22.33 180 bottom
LED80  SMLD12BN1WT86  [LEDM168X65N]  148.5,22.83 0 bottom
LED81  SMLD12BN1WT86  [LEDM168X65N]  148.44,15.51 0 bottom
LED82  SMLD12BN1WT86  [LEDM168X65N]  148.46,7.97 0 bottom
LED83  SMLD12BN1WT86  [LEDM168X65N]  8.25,16.89 180 bottom
LED84  SMLD12BN1WT86  [LEDM168X65N]  11.37,6.82 180 bottom
LED85  AA3021LSYSK_J3-TR  [AA3021LSYSKJ3TR]  52.21,12.59 270 bottom
LED86  AA3021LSYSK_J3-TR  [AA3021LSYSKJ3TR]  57.32,13.14 90 bottom
LED87  AA3021LSYSK_J3-TR  [AA3021LSYSKJ3TR]  51.46,5.68 90 bottom
LED88  AA3021LSYSK_J3-TR  [AA3021LSYSKJ3TR]  55.52,5.67 90 bottom
LED89  AA3021LSYSK_J3-TR  [AA3021LSYSKJ3TR]  62.25,13.08 90 bottom
LED90  AA3021LSYSK_J3-TR  [AA3021LSYSKJ3TR]  67.4,13.08 90 bottom
LED91  AA3021LSYSK_J3-TR  [AA3021LSYSKJ3TR]  59.58,5.71 90 bottom
LED92  AA3021LSYSK_J3-TR  [AA3021LSYSKJ3TR]  64.72,6.75 0 bottom
LED93  AA3021LSYSK_J3-TR  [AA3021LSYSKJ3TR]  134.39,95.3 270 bottom
LED94  AA3021LSYSK_J3-TR  [AA3021LSYSKJ3TR]  130.39,95.29 270 bottom
LED95  AA3021LSYSK_J3-TR  [AA3021LSYSKJ3TR]  126.38,95.28 270 bottom
LED96  AA3021LSYSK_J3-TR  [AA3021LSYSKJ3TR]  122.37,95.28 270 bottom
LED97  ASMT-URB4-YU802  [ASMTURB4YU802]  49.57,53.47 90 bottom
LED98  ASMT-URB4-YU802  [ASMTURB4YU802]  63.03,53.72 90 bottom
LED99  ASMT-URB4-YU802  [ASMTURB4YU802]  49.7,42.16 270 bottom
LED100  ASMT-URB4-YU802  [ASMTURB4YU802]  63.16,42.67 270 bottom
LED101  ASMT-URB4-YU802  [ASMTURB4YU802]  63.16,36.07 270 bottom
LED102  ASMT-URB4-YU802  [ASMTURB4YU802]  49.7,35.69 270 bottom
LED103  ASMT-URB4-YU802  [ASMTURB4YU802]  6.52,26.67 0 bottom
LED104  ASMT-URB4-YU802  [ASMTURB4YU802]  39.92,26.8 180 bottom
LED105  ASMT-URB4-YU802  [ASMTURB4YU802]  152.32,27.56 90 bottom
LED106  ASMT-URB4-YU802  [ASMTURB4YU802]  152.32,34.16 270 bottom
LED107  ASMT-URB4-YU802  [ASMTURB4YU802]  110.79,28.07 0 bottom
LED108  ASMT-URB4-YU802  [ASMTURB4YU802]  116.37,27.18 270 bottom
LED109  ASMT-URB4-YU802  [ASMTURB4YU802]  96.18,37.85 270 bottom
LED110  ASMT-URB4-YU802  [ASMTURB4YU802]  95.42,49.91 90 bottom
LED111  ASMT-URB4-YU802  [ASMTURB4YU802]  110.28,43.94 270 bottom
LED112  ASMT-URB4-YU802  [ASMTURB4YU802]  110.02,53.21 90 bottom
LED113  ASMT-URB4-YU802  [ASMTURB4YU802]  140.63,2.54 180 bottom
LED114  ASMT-URB4-YU802  [ASMTURB4YU802]  134.15,2.54 180 bottom
LED_1  SMALL_TP  [SMALL_TP]  129.64,105.01 180 bottom
LED_2  SMALL_TP  [SMALL_TP]  127.1,105.01 180 bottom
LED_3  SMALL_TP  [SMALL_TP]  124.56,105.01 180 bottom
LED_P  SMALL_TP  [SMALL_TP]  132.18,105.01 0 bottom
M1  NTLUS4C12NTAG  [TRANS_NTLUS3A18PZTAG]  33.32,56.24 0 top
M2  NTLUS4C12NTAG  [TRANS_NTLUS3A18PZTAG]  33.3,53.41 180 top
M3  NTLUS4C12NTAG  [TRANS_NTLUS3A18PZTAG]  32.36,48.75 0 top
M4  NTLUS4C12NTAG  [TRANS_NTLUS3A18PZTAG]  32.35,46.11 180 top
M5  NTLUS4C12NTAG  [TRANS_NTLUS3A18PZTAG]  126.64,28.98 180 top
M6  NTLUS4C12NTAG  [TRANS_NTLUS3A18PZTAG]  126.64,31.61 0 top
M7  NTLUS4C12NTAG  [TRANS_NTLUS3A18PZTAG]  126.88,36.5 180 top